# EAGLE board Easy_RFPA_RevC (EAGLE 6.6.0)
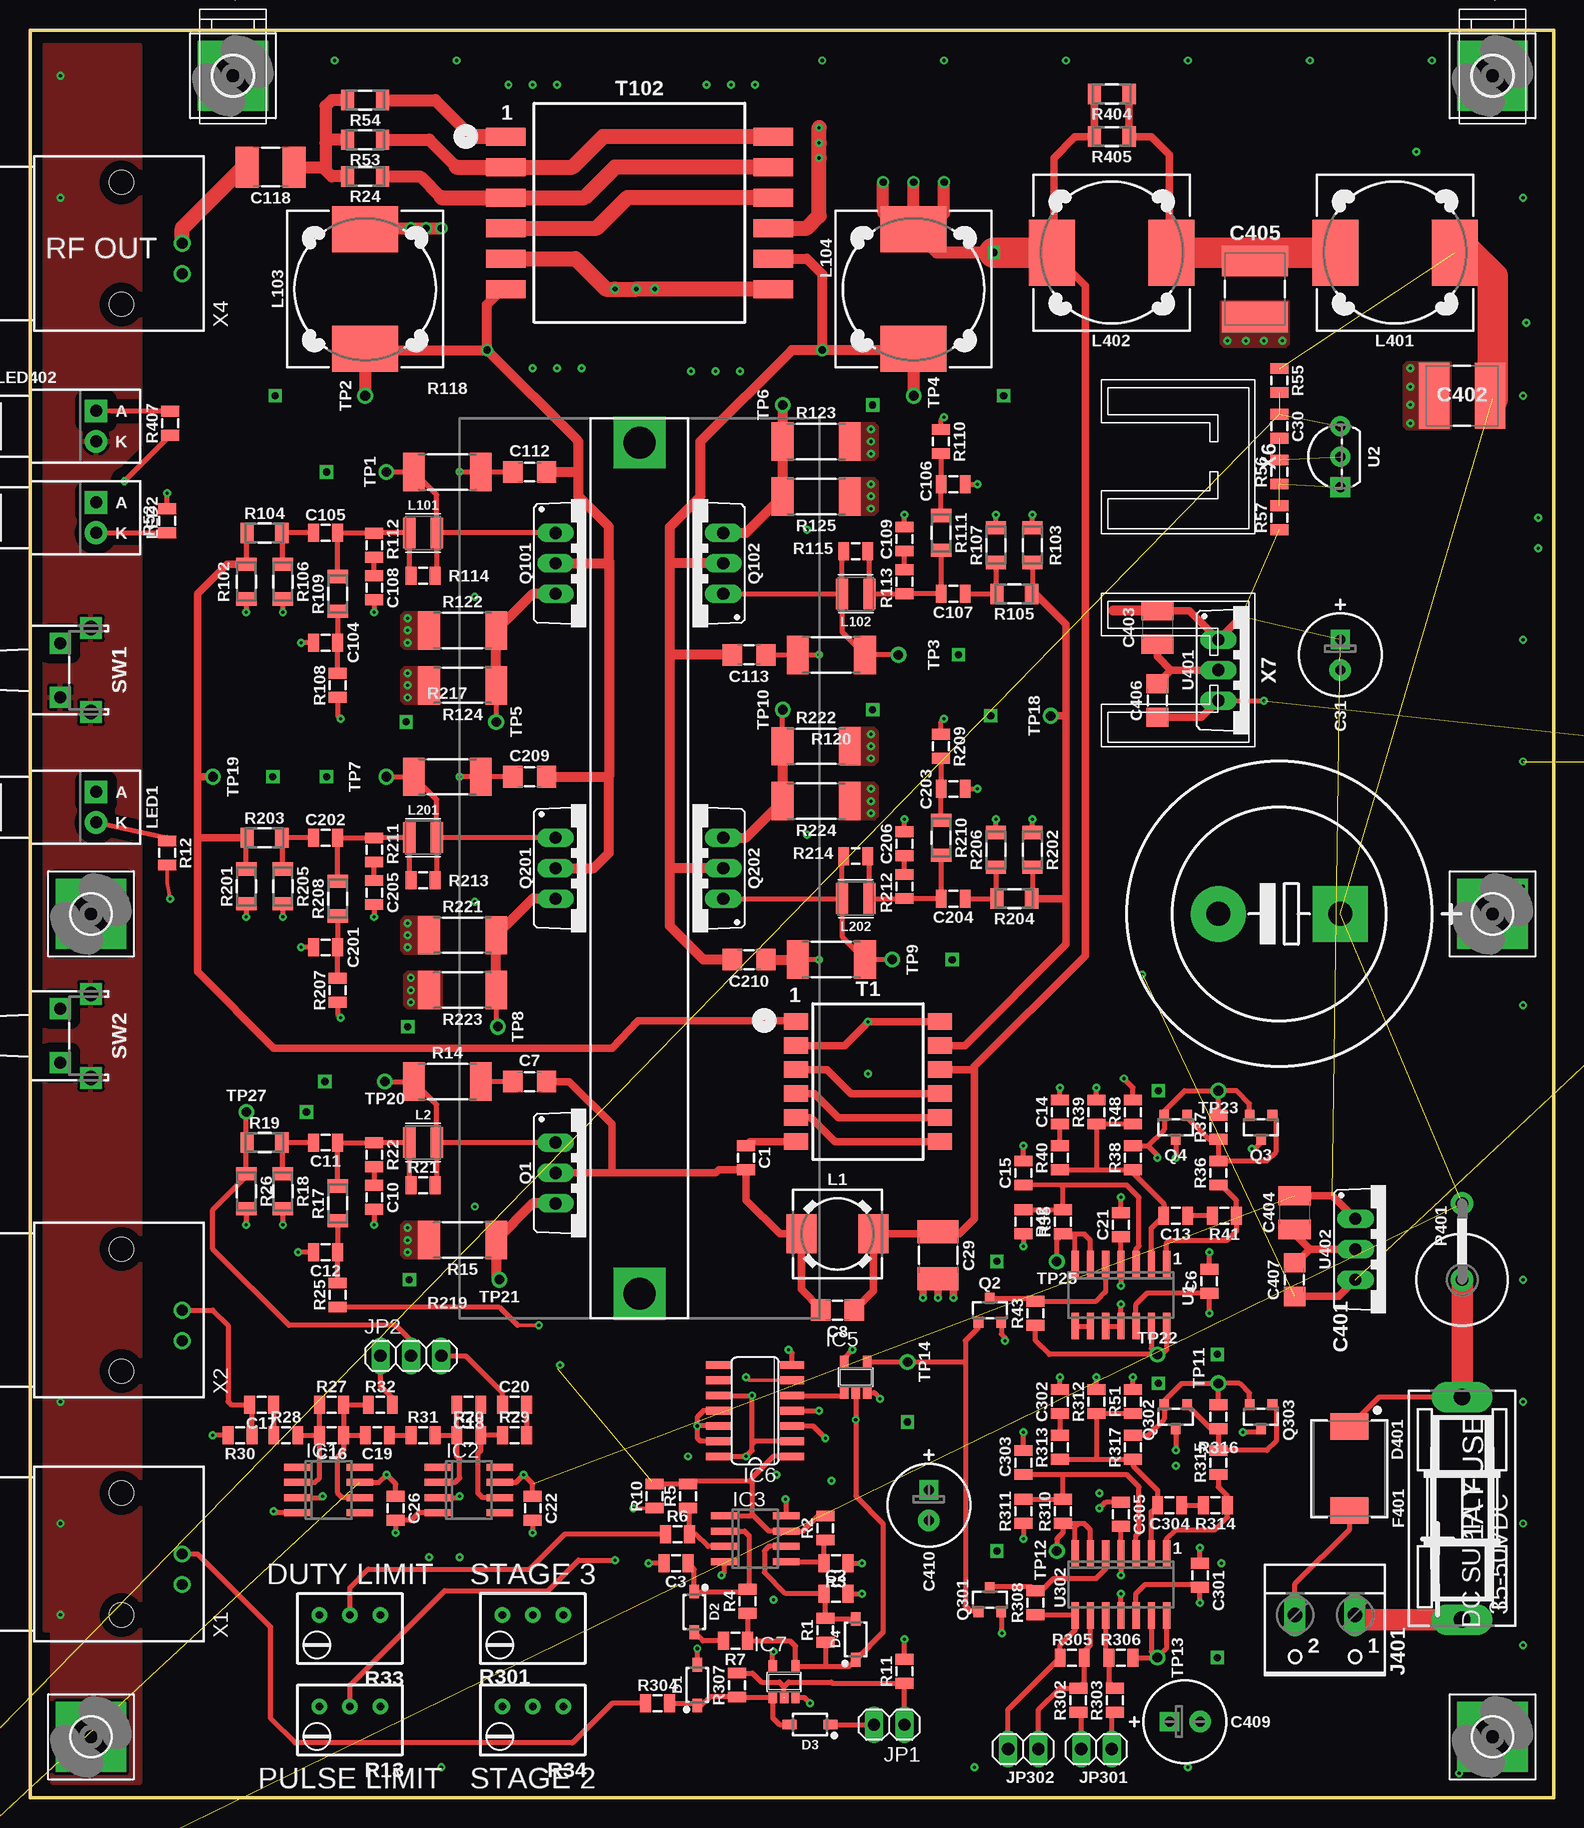
[diagram p6: board, top side]
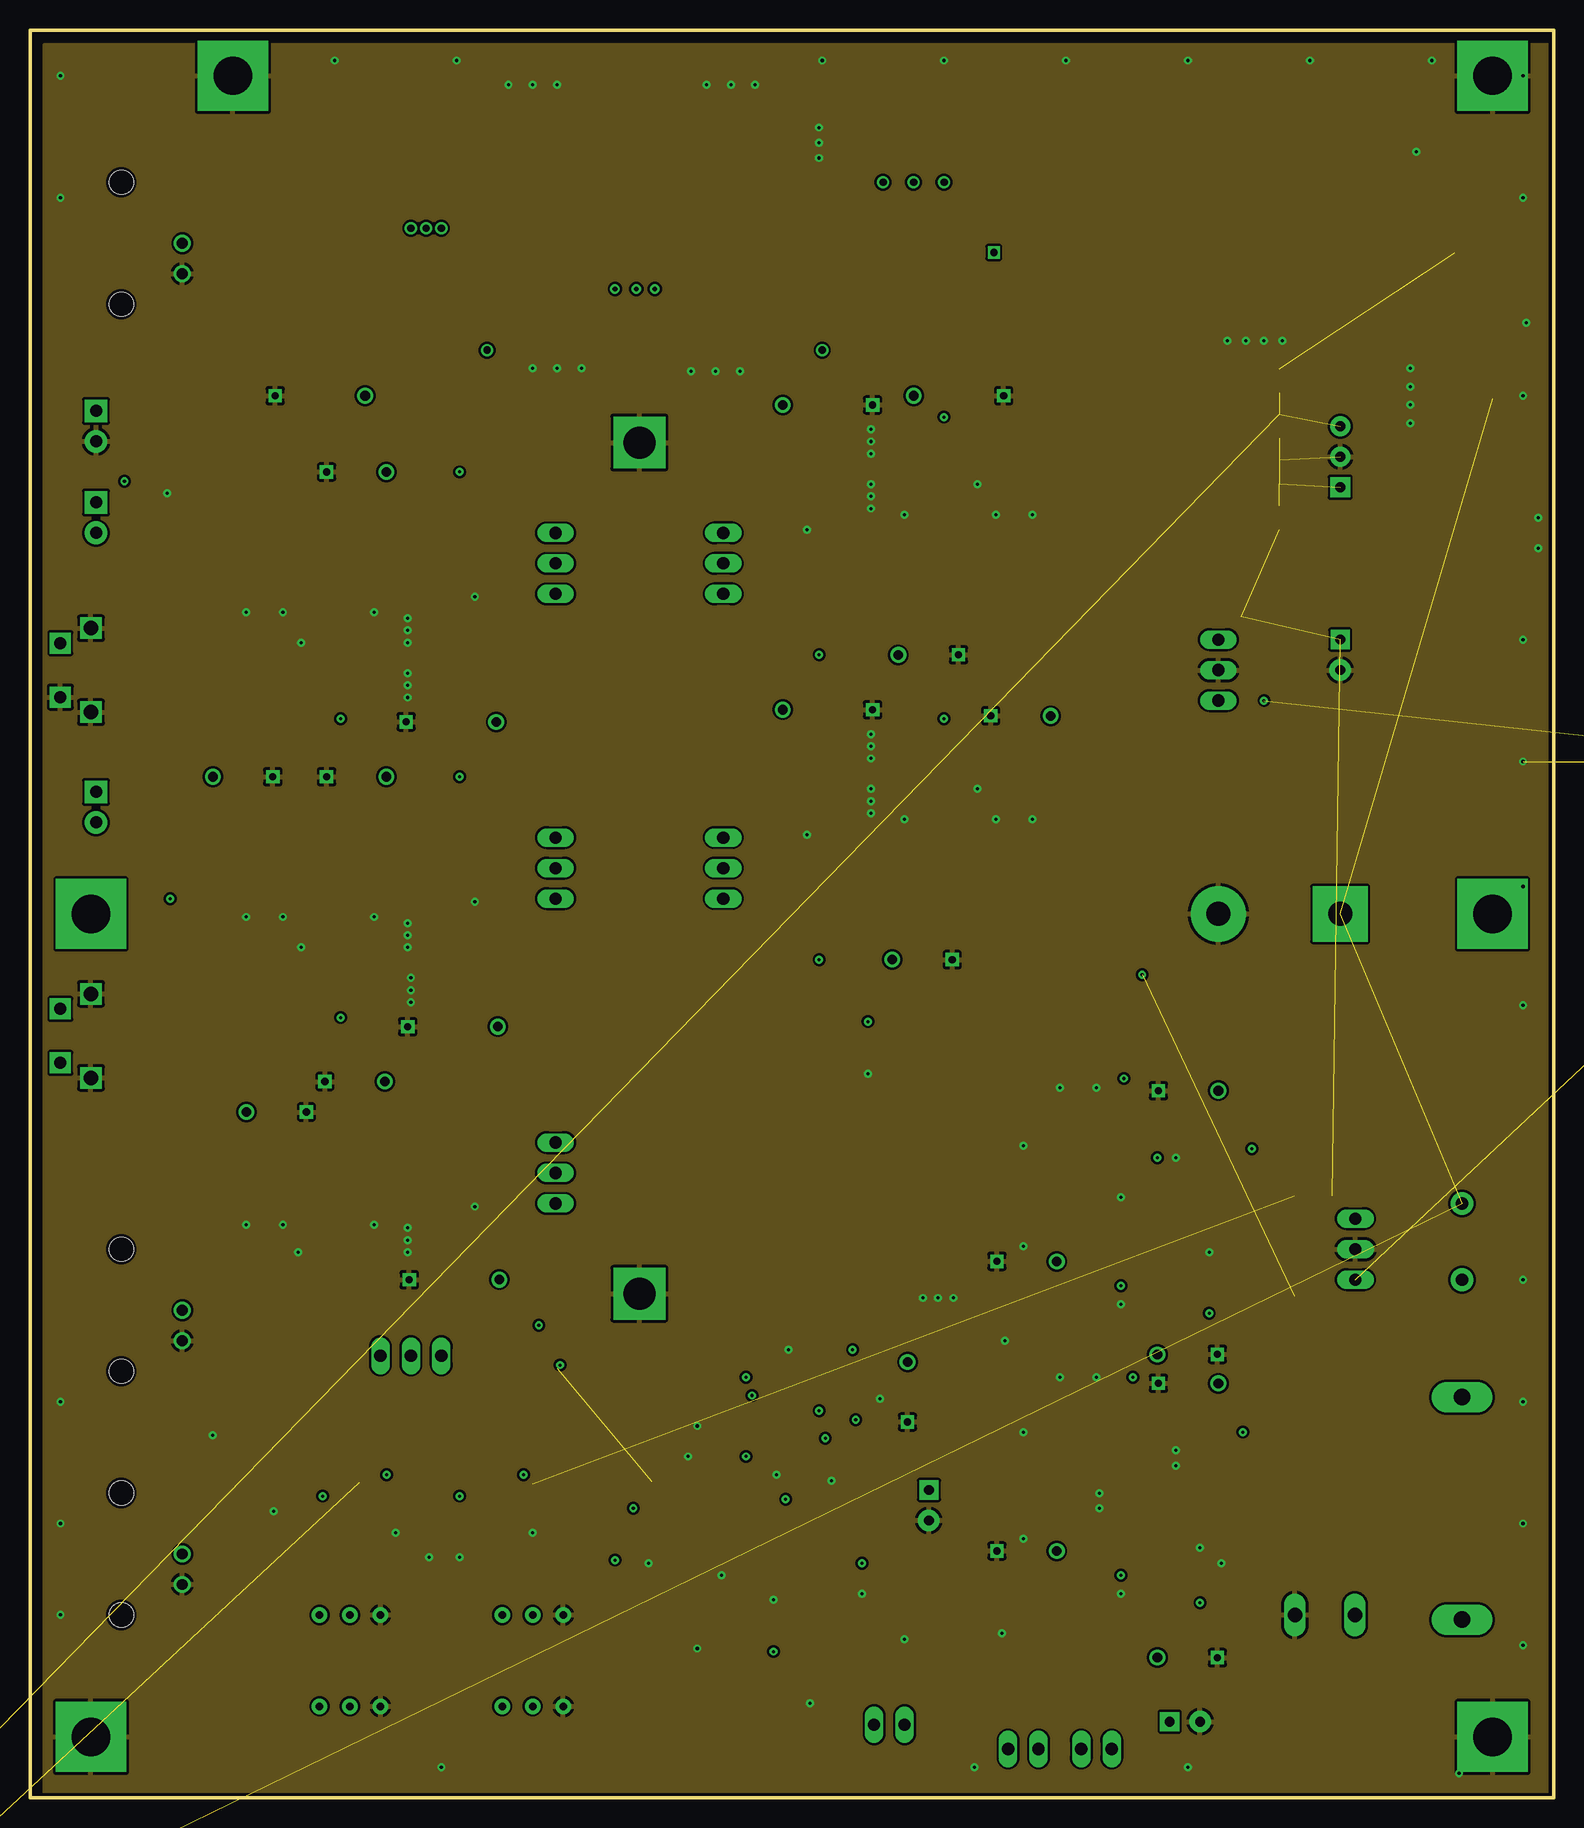
[diagram p7: board, inner layer Route2]
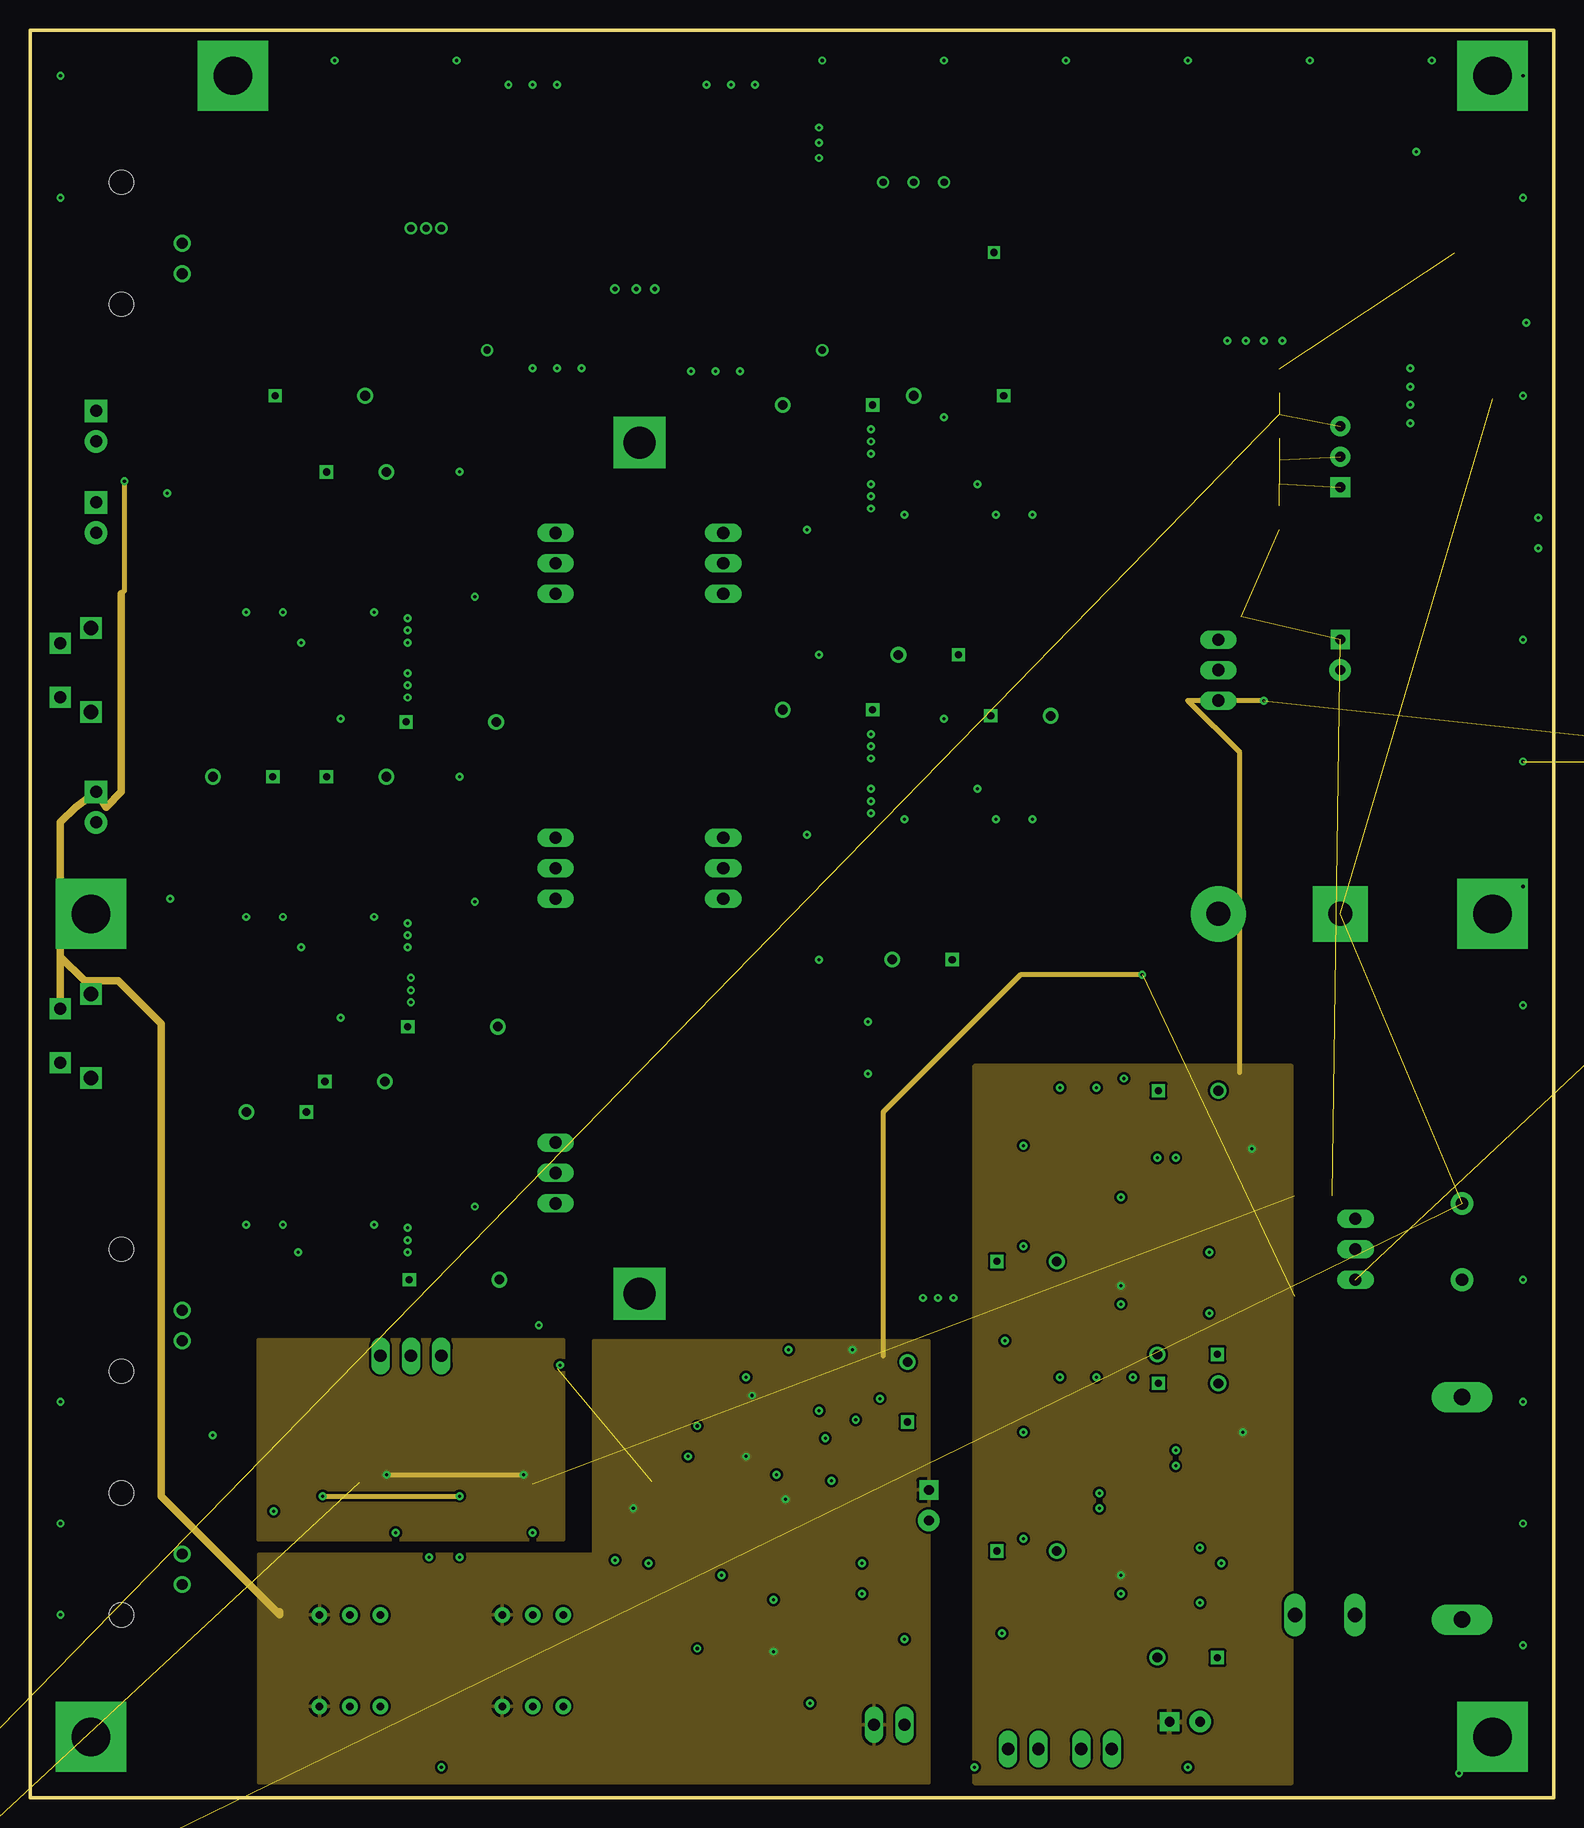
[diagram p8: board, inner layer Route15]
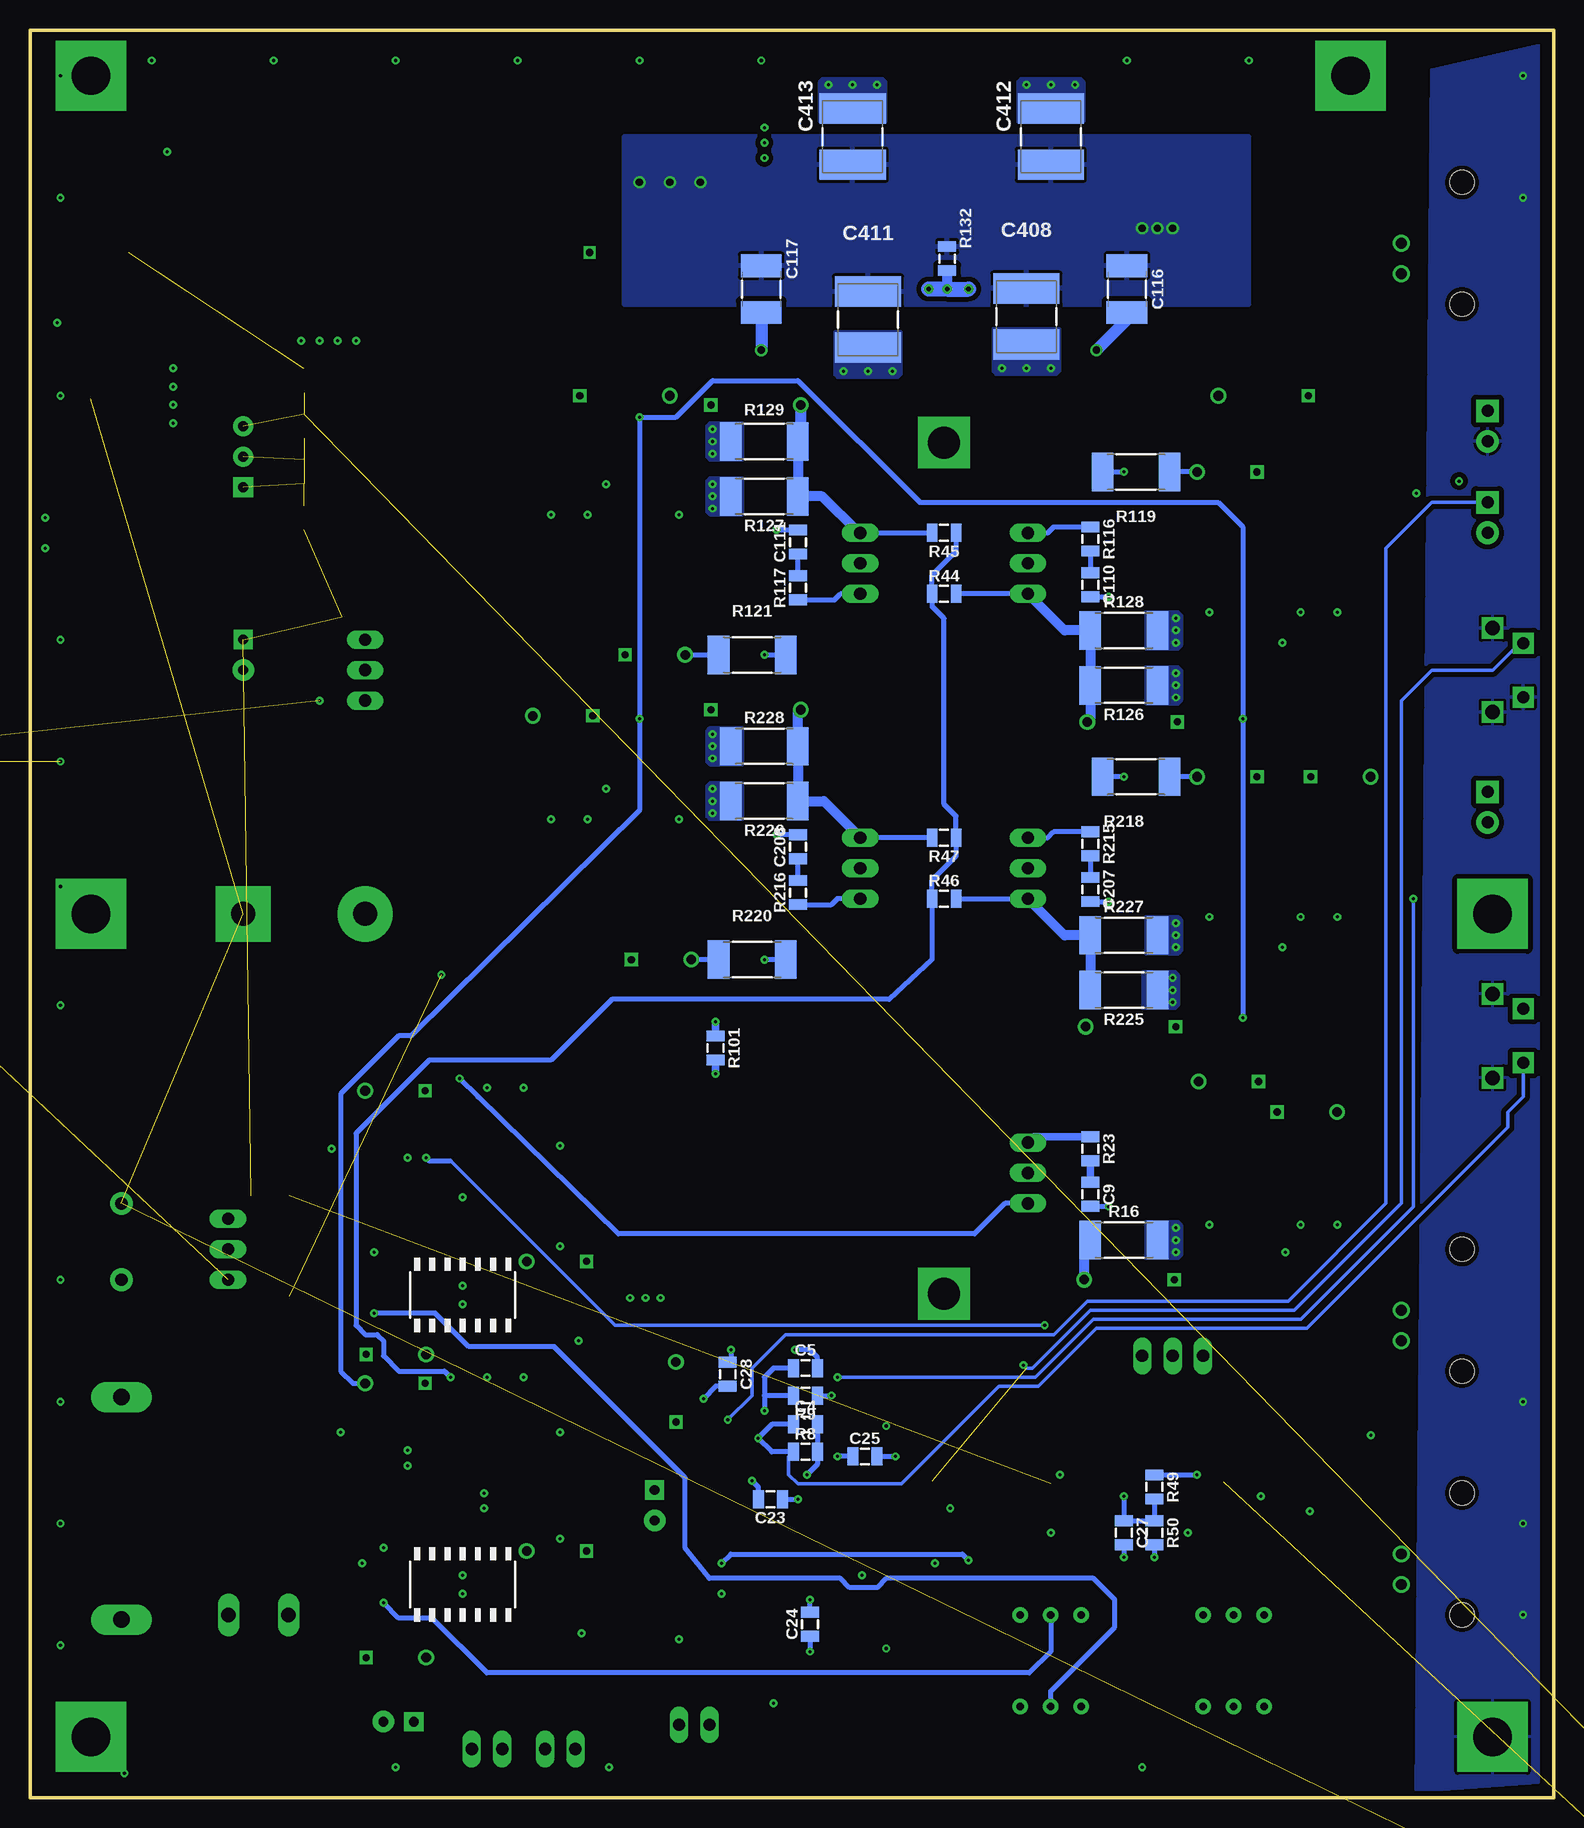
[diagram p9: board, bottom side, seen from below]

Size 127 x 147.32 mm. Coordinates in mm from the lower left corner, seen from the top.
Outline: 0,0 127,0 127,147.32 0,147.32 0,0
Copper layers (1+2*15+16): Top 0.035mm / dielectric 1.5mm / Route2 0.035mm / dielectric 0.15mm / Route15 0.035mm / dielectric 0.2mm / Bottom 0.035mm
Design rules "default *": minimum track width 10mil, minimum drill 10mil, track to track 8mil, track to pad 8mil, pad to pad 8mil, via to via 8mil, smd to smd 0mil, copper to edge 10mil, drill to drill 8mil, minimum pad ring 10mil, minimum via ring 8mil, stop-mask expansion 4mil, vias tented up to drill 10mil, thermal gap 10mil
Net classes: 1 32W_20S: width 0.813 mm, drill 0.6 mm, clearance 0.508 mm; 2 32W_30S: width 0.813 mm, drill 0.6 mm, clearance 0.762 mm; 3 50W_30S: width 1.27 mm, drill 0.6 mm, clearance 0.762 mm

## Footprints (pad centres in the part's own frame; a part is rotated, then mirrored left to right if it is on the bottom)
0805_IPC-7351B = smd 0.9 x 1.5: 1 -1,0; 2 1,0
C1206 = smd 1.6 x 1.8: 1 -1.4,0; 2 1.4,0
C1812 = smd 1.9 x 3.4: 1 -1.95,0; 2 1.95,0
E2,5-7 = drill 0.813 pad 1.6 square: + -1.27,0 | drill 0.813 pad 1.778: - 1.27,0
EB25D = drill 2.007 pad 4.597 square: + -5.08,0 | drill 2.007 pad 4.597: - 5.08,0
C2220_CKG57N = smd 2.53 x 5.51: 1 -2.335,0; 2 2.335,0
C1210 = smd 1.6 x 2.7: 1 -1.4,0; 2 1.4,0
SOD123 = smd 1.15 x 0.8: A 1.7,0; K -1.7,0
DO-214AB(SMC) = smd 2.2 x 3.15: A 3.5,0; K -3.5,0
02540121Z = drill 1.4 pad 2.54 long: 1 -9.271,0; 2 9.271,0
3,2-PAD-SQUARE = drill 3.2 pad 5.842 square: B3,2 0,0
SO08 = smd 0.6 x 2.2: 1 -1.905,-2.6; 2 -0.635,-2.6; 3 0.635,-2.6; 4 1.905,-2.6; 5 1.905,2.6; 6 0.635,2.6; 7 -0.635,2.6; 8 -1.905,2.6
SOT23-5 = smd 0.69 x 0.99: 1 -0.95,-1.29; 2 0,-1.29; 3 0.95,-1.29; 4 0.95,1.3; 5 -0.95,1.3
SO14 = smd 0.66 x 2.032: 1 -3.81,-3.073; 2 -2.54,-3.073; 3 -1.27,-3.073; 4 0,-3.073; 5 1.27,-3.073; 6 2.54,-3.073; 7 3.81,-3.073; 8 3.81,3.073; 9 2.54,3.073; 10 1.27,3.073; 11 0,3.073; 12 -1.27,3.073; 13 -2.54,3.073; 14 -3.81,3.073
W237-02 = drill 1.194 long: 1 -2.5,-1.27; 2 2.5,-1.27
47053-1000 = drill 1 pad 1.93 square: 1 3.81,0 | drill 1 pad 1.93: 2 1.27,0; 3 -1.27,0; 4 -3.81,0 | hole 1.3: -1.27,-2.16
1X02 = drill 1.016 long: 1 -1.27,0; 2 1.27,0
1X03 = drill 1.016 long: 1 -2.54,0; 2 0,0; 3 2.54,0
DR74 = smd 2.5 x 3.25: 1 -3,0; 2 3,0
L1008 = smd 1.02 x 2.54: 1 -1.145,0; 2 1.145,0
DR127 = smd 3.85 x 5.5: 1 -4.975,0; 2 4.975,0
LED_5MM_RA = drill 1 pad 1.905 square: A 5.5,1.27 | drill 1 pad 1.905: K 5.5,-1.27
TO220BV = drill 1.016 long: D 0,-2.54; G -2.54,-2.54; S 2.54,-2.54
SOT23R_INFINEON = smd 0.8 x 0.9: 1 -0.95,-1; 2 0.95,-1; 3 0,1
RTRIM3299W = drill 0.61 pad 1.27: 1 1.27,-2.54; 2 1.27,0; 3 1.27,2.54
R2512 = smd 1.8 x 3.2: 1 -2.8,0; 2 2.8,0
1206_IPC-7351B = smd 1.1 x 1.7: 1 -1.45,0; 2 1.45,0
P0817V = drill 1.016 pad 1.905: 1 -5.08,0; 2 1.27,0
431256083716 = drill 1.2 square: 1 -3.5,2.54; 4 3.5,2.54 | drill 1 pad 1.75 square: 2 -2.25,0; 3 2.25,0
HP1 = smd 2 x 1.4: 1 -6,5; 2 -6,3; 3 -6,1; 4 -6,-1; 5 -6,-3; 6 -6,-5; 7 6,-5; 8 6,-3; 9 6,-1; 10 6,1; 11 6,3; 12 6,5
HP4 = smd 3.3 x 1.5: 1 -11.15,6.35; 2 -11.15,3.81; 3 -11.15,1.27; 4 -11.15,-1.27; 5 -11.15,-3.81; 6 -11.15,-6.35; 7 11.15,-6.35; 8 11.15,-3.81; 9 11.15,-1.27; 10 11.15,1.27; 11 11.15,3.81; 12 11.15,6.35
PROBE_TP_5MM = drill 0.6 square: GND 5,0 | drill 0.8: TP 0,0
PROBE_TP_7P5MM = drill 0.6 square: GND 7.5,0 | drill 0.8: TP 0,0
SO14' = smd 0.6 x 2.2: 1 -3.81,-2.6; 2 -2.54,-2.6; 3 -1.27,-2.6; 4 0,-2.6; 5 1.27,-2.6; 6 2.54,-2.6; 7 3.81,-2.6; 8 3.81,2.6; 9 2.54,2.6; 10 1.27,2.6; 11 0,2.6; 12 -1.27,2.6; 13 -2.54,2.6; 14 -3.81,2.6
TO-92-FORMED = drill 0.813 pad 1.676 square: 1 -2.54,0 | drill 0.813 pad 1.676: 2 0,0; 3 2.54,0
TO220BV' = drill 1.016 long: 1 -2.54,-2.54; 2 0,-2.54; 3 2.54,-2.54
AMP_227161 = drill 0.9 pad 1.27: 1 0,-5.08; 2 -2.54,-5.08 | hole 2: -5.08,0; 5.08,0
OMNI-UNI-30-75-D = drill 2.667 pad 4.318 square: P1 0,35.47; P2 0,-35.47

## Placement (x,y rotation side)
C1  27nF  [0805_IPC-7351B]  59.69,53.34 270 top
C2  0.1uF  [0805_IPC-7351B]  67.18,17.02 0 top
C3  10uF  [0805_IPC-7351B]  53.85,19.56 180 top
C4  10nF  [0805_IPC-7351B]  62.36,31.12 0 bottom
C5  1uF  [0805_IPC-7351B]  62.36,35.81 0 bottom
C6  0.1uF  [0805_IPC-7351B]  98.3,43.05 90 top
C7  2.2nF  [C1206]  41.66,59.69 0 top
C8  22nF  [C1206]  67.31,40.64 180 top
C9  DNP  [0805_IPC-7351B]  38.61,50.29 270 bottom
C10  DNP  [0805_IPC-7351B]  28.7,50.04 270 top
C11  4.7nF  [0805_IPC-7351B]  24.64,54.61 180 top
C12  22nF  [0805_IPC-7351B]  24.64,45.47 180 top
C13  33pF  [0805_IPC-7351B]  95.5,48.51 180 top
C14  DNP  [0805_IPC-7351B]  85.85,57.15 90 top
C15  DNP  [0805_IPC-7351B]  82.8,52.07 90 top
C16  10pF  [0805_IPC-7351B]  25.15,30.23 180 top
C17  22nF  [0805_IPC-7351B]  19.3,32.77 180 top
C18  10pF  [0805_IPC-7351B]  36.58,32.77 180 top
C19  22nF  [0805_IPC-7351B]  28.96,30.23 180 top
C20  22nF  [0805_IPC-7351B]  40.39,32.77 0 top
C21  0.1uF  [0805_IPC-7351B]  90.93,47.75 90 top
C22  0.1uF  [0805_IPC-7351B]  41.91,24.13 270 top
C23  0.1uF  [0805_IPC-7351B]  65.28,24.89 180 bottom
C24  0.1uF  [0805_IPC-7351B]  61.98,14.48 90 bottom
C25  0.1uF  [0805_IPC-7351B]  57.4,28.45 0 bottom
C26  0.1uF  [0805_IPC-7351B]  30.48,24.13 270 top
C27  0.1uF  [0805_IPC-7351B]  35.81,22.1 270 bottom
C28  0.1uF  [0805_IPC-7351B]  68.83,35.31 270 bottom
C29  DNP  [C1812]  75.69,45.21 270 top
C30  33pF  [0805_IPC-7351B]  104.14,114.3 270 top
C31  22uF  [E2,5-7]  109.22,95.25 270 top
C104  22nF  [0805_IPC-7351B]  24.64,96.27 180 top
C105  27nF  [0805_IPC-7351B]  24.64,105.41 180 top
C106  22nF  [0805_IPC-7351B]  76.96,109.47 0 top
C107  27nF  [0805_IPC-7351B]  76.96,100.33 0 top
C108  DNP  [0805_IPC-7351B]  28.7,100.84 270 top
C109  DNP  [0805_IPC-7351B]  72.9,104.9 90 top
C110  DNP  [0805_IPC-7351B]  38.61,101.09 270 bottom
C111  DNP  [0805_IPC-7351B]  62.99,104.65 90 bottom
C112  2.2nF  [C1206]  41.66,110.49 0 top
C113  2.2nF  [C1206]  59.94,95.25 180 top
C116  DNP  [C1812]  35.56,125.73 270 bottom
C117  DNP  [C1812]  66.04,125.73 270 bottom
C118  DNP  [C1812]  20.07,135.89 180 top
C201  22nF  [0805_IPC-7351B]  24.64,70.87 180 top
C202  27nF  [0805_IPC-7351B]  24.64,80.01 180 top
C203  22nF  [0805_IPC-7351B]  76.96,84.07 0 top
C204  27nF  [0805_IPC-7351B]  76.96,74.93 0 top
C205  DNP  [0805_IPC-7351B]  28.7,75.44 270 top
C206  DNP  [0805_IPC-7351B]  72.9,79.5 90 top
C207  DNP  [0805_IPC-7351B]  38.61,75.69 270 bottom
C208  DNP  [0805_IPC-7351B]  62.99,79.25 90 bottom
C209  2.2nF  [C1206]  41.66,85.09 0 top
C210  2.2nF  [C1206]  59.94,69.85 180 top
C301  0.1uF  [0805_IPC-7351B]  97.54,18.54 90 top
C302  DNP  [0805_IPC-7351B]  85.85,33.02 90 top
C303  DNP  [0805_IPC-7351B]  82.8,27.94 90 top
C304  33pF  [0805_IPC-7351B]  95,24.38 180 top
C305  0.1uF  [0805_IPC-7351B]  90.93,23.62 90 top
C401  3300uF  [EB25D]  104.14,73.66 180 top
C402  10uF  [C2220_CKG57N]  119.38,116.84 180 top
C403  6.8uF  [C1210]  93.98,97.54 270 top
C404  6.8uF  [C1210]  105.41,48.77 270 top
C405  10uF  [C2220_CKG57N]  102.11,125.73 270 top
C406  4.7uF  [C1206]  93.98,91.44 90 top
C407  4.7uF  [C1206]  105.41,43.18 90 top
C408  10uF  [C2220_CKG57N]  43.94,123.44 270 bottom
C409  22uF  [E2,5-7]  96.27,6.35 0 top
C410  22uF  [E2,5-7]  74.93,24.38 270 top
C411  10uF  [C2220_CKG57N]  57.15,123.19 270 bottom
C412  10uF  [C2220_CKG57N]  41.91,138.43 90 bottom
C413  10uF  [C2220_CKG57N]  58.42,138.43 90 bottom
D1  D-SCHOTTKY1N5711W-7-FSOD123  [SOD123]  55.63,9.4 90 top
D2  D-SCHOTTKY1N5711W-7-FSOD123  [SOD123]  55.37,15.49 270 top
D3  D-SCHOTTKY1N5711W-7-FSOD123  [SOD123]  65.02,6.1 180 top
D4  D-SCHOTTKY1N5711W-7-FSOD123  [SOD123]  68.83,13.21 90 top
D401  D-SCHOTTKYSK810L-TPSMC  [DO-214AB(SMC)]  109.98,27.43 270 top
F401  FUSE_2P  [02540121Z]  119.38,24.13 90 top
H1  MOUNT-PAD-SQUARE3.2  [3,2-PAD-SQUARE]  5.08,73.66 0 top
H2  MOUNT-PAD-SQUARE3.2  [3,2-PAD-SQUARE]  121.92,73.66 0 top
H401  MOUNT-PAD-SQUARE3.2  [3,2-PAD-SQUARE]  5.08,5.08 0 top
H402  MOUNT-PAD-SQUARE3.2  [3,2-PAD-SQUARE]  121.92,5.08 0 top
H403  MOUNT-PAD-SQUARE3.2  [3,2-PAD-SQUARE]  121.92,143.51 0 top
H404  MOUNT-PAD-SQUARE3.2  [3,2-PAD-SQUARE]  16.92,143.51 0 top
IC1  LM741D  [SO08]  24.89,25.65 270 top
IC2  LM741D  [SO08]  36.58,25.65 270 top
IC3  LM393D  [SO08]  60.45,21.59 270 top
IC5  74AHC1G00DBV  [SOT23-5]  68.83,35.05 0 top
IC6  74LS74D  [SO14]  60.45,32.26 90 top
IC7  74AHC1G86DBV  [SOT23-5]  62.87,9.65 0 top
J401  HDR_2X1282836-1282836-1  [W237-02]  107.95,13.97 180 top
J402  KK_PCFAN  [47053-1000]  148.59,86.36 0 top  (outside the outline)
JP1  [1X02]  71.63,6.1 180 top
JP2  [1X03]  31.75,36.83 0 top
JP301  [1X02]  88.9,4.06 180 top
JP302  [1X02]  82.8,4.06 180 top
L1  [DR74]  67.31,46.99 0 top
L2  47nH  [L1008]  32.77,54.61 0 top
L101  47nH  [L1008]  32.77,105.41 0 top
L102  47nH  [L1008]  68.83,100.33 180 top
L103  3.3uH  [DR127]  27.94,125.73 90 top
L104  3.3uH  [DR127]  73.66,125.73 90 top
L201  47nH  [L1008]  32.77,80.01 0 top
L202  47nH  [L1008]  68.83,74.93 180 top
L401  3.3uH  [DR127]  113.79,128.78 180 top
L402  22uH  [DR127]  90.17,128.78 180 top
LED1  LEDT1_3/4_RA  [LED_5MM_RA]  0,82.55 0 top
LED2  LEDT1_3/4_RA  [LED_5MM_RA]  0,106.68 0 top
LED402  LEDT1_3/4_RA  [LED_5MM_RA]  0,114.3 0 top
Q1  IRF630  [TO220BV]  46.35,52.07 270 top
Q2  MOSFET_NBSS123SOT23  [SOT23R_INFINEON]  80.01,40.64 0 top
Q3  NPNMMBT3904SOT23_BEC  [SOT23R_INFINEON]  102.62,55.88 180 top
Q4  PNPSOT23_BEC  [SOT23R_INFINEON]  95.5,55.88 180 top
Q6  NPN_DARGLINGTONTIP122TO220BV  [TO220BV]  -26.67,-19.05 0 top  (outside the outline)
Q101  IRF520N  [TO220BV]  46.35,102.87 270 top
Q102  IRF630  [TO220BV]  55.24,102.87 90 top
Q201  IRF630  [TO220BV]  46.35,77.47 270 top
Q202  IRF630  [TO220BV]  55.24,77.47 90 top
Q301  MOSFET_NBSS123SOT23  [SOT23R_INFINEON]  80.01,16.51 0 top
Q302  PNPSOT23_BEC  [SOT23R_INFINEON]  95.5,31.75 180 top
Q303  NPNMMBT3904SOT23_BEC  [SOT23R_INFINEON]  102.62,31.75 180 top
R1  10K  [0805_IPC-7351B]  66.29,13.97 90 top
R2  1M  [0805_IPC-7351B]  66.29,22.48 90 top
R3  1K  [0805_IPC-7351B]  67.18,19.56 180 top
R4  100K  [0805_IPC-7351B]  59.82,16.38 90 top
R5  1M  [0805_IPC-7351B]  54.86,25.15 90 top
R6  1K  [0805_IPC-7351B]  53.98,21.97 0 top
R7  10K  [0805_IPC-7351B]  58.8,13.08 180 top
R8  10K  [0805_IPC-7351B]  62.36,28.83 0 bottom
R9  100K  [0805_IPC-7351B]  62.36,33.53 180 bottom
R10  4.7K  [0805_IPC-7351B]  52.07,25.15 90 top
R11  10K  [0805_IPC-7351B]  72.9,10.54 90 top
R12  150  [0805_IPC-7351B]  11.43,78.74 270 top
R13  10K  [RTRIM3299W]  26.67,6.35 90 top
R14  1200  [R2512]  34.8,59.69 0 top
R15  3  [R2512]  36.07,46.48 180 top
R16  3  [R2512]  35.81,46.48 0 bottom
R17  500  [1206_IPC-7351B]  25.65,49.53 90 top
R18  DNP  [1206_IPC-7351B]  21.08,50.55 270 top
R19  0  [1206_IPC-7351B]  19.56,54.61 0 top
R20  300  [0805_IPC-7351B]  36.58,30.23 0 top
R21  15  [0805_IPC-7351B]  32.77,51.05 0 top
R22  DNP  [0805_IPC-7351B]  28.7,53.59 270 top
R23  DNP  [0805_IPC-7351B]  38.61,54.1 270 bottom
R24  0  [1206_IPC-7351B]  27.94,135.13 180 top
R25  100  [0805_IPC-7351B]  25.65,41.91 90 top
R26  DNP  [1206_IPC-7351B]  18.03,50.55 270 top
R27  300  [0805_IPC-7351B]  25.15,32.77 0 top
R28  100  [0805_IPC-7351B]  21.34,30.23 0 top
R29  50  [0805_IPC-7351B]  40.39,30.23 0 top
R30  100  [0805_IPC-7351B]  17.53,30.23 180 top
R31  100  [0805_IPC-7351B]  32.77,30.23 0 top
R32  50  [0805_IPC-7351B]  29.21,32.77 0 top
R33  10K  [RTRIM3299W]  26.67,13.97 90 top
R34  10K  [RTRIM3299W]  41.91,6.35 90 top
R35  1K  [0805_IPC-7351B]  86.11,48.01 90 top
R36  10  [0805_IPC-7351B]  99.06,52.07 90 top
R37  100  [0805_IPC-7351B]  99.06,55.88 90 top
R38  10K  [0805_IPC-7351B]  91.95,53.34 90 top
R39  10K  [0805_IPC-7351B]  88.9,57.15 270 top
R40  DNP  [0805_IPC-7351B]  85.85,53.34 270 top
R41  0  [0805_IPC-7351B]  99.57,48.51 180 top
R42  DNP  [0805_IPC-7351B]  82.8,48.01 270 top
R43  1K  [0805_IPC-7351B]  83.82,40.39 90 top
R44  1K  [0805_IPC-7351B]  50.8,100.33 0 bottom
R45  1K  [0805_IPC-7351B]  50.8,105.41 180 bottom
R46  1K  [0805_IPC-7351B]  50.8,74.93 0 bottom
R47  1K  [0805_IPC-7351B]  50.8,80.01 180 bottom
R48  DNP  [0805_IPC-7351B]  91.95,57.15 90 top
R49  10K  [0805_IPC-7351B]  33.27,25.91 270 bottom
R50  10K  [0805_IPC-7351B]  33.27,22.1 270 bottom
R51  DNP  [0805_IPC-7351B]  91.95,33.02 90 top
R52  150  [0805_IPC-7351B]  11.43,106.43 90 top
R53  0  [1206_IPC-7351B]  27.94,138.18 180 top
R54  0  [1206_IPC-7351B]  27.94,141.48 180 top
R55  590  [0805_IPC-7351B]  104.14,118.11 270 top
R56  590  [0805_IPC-7351B]  104.14,110.49 90 top
R57  590  [0805_IPC-7351B]  104.14,106.68 90 top
R101  0  [0805_IPC-7351B]  69.85,62.48 270 bottom
R102  75  [1206_IPC-7351B]  18.03,101.35 270 top
R103  75  [1206_IPC-7351B]  83.57,104.39 90 top
R104  4.99  [1206_IPC-7351B]  19.56,105.41 0 top
R105  4.99  [1206_IPC-7351B]  82.04,100.33 180 top
R106  75  [1206_IPC-7351B]  21.08,101.35 270 top
R107  75  [1206_IPC-7351B]  80.52,104.39 90 top
R108  100  [0805_IPC-7351B]  25.65,92.71 90 top
R109  100  [1206_IPC-7351B]  25.65,100.33 90 top
R110  100  [0805_IPC-7351B]  75.95,113.03 270 top
R111  100  [1206_IPC-7351B]  75.95,105.41 270 top
R112  DNP  [0805_IPC-7351B]  28.7,104.39 270 top
R113  DNP  [0805_IPC-7351B]  72.9,101.35 90 top
R114  15  [0805_IPC-7351B]  32.77,101.85 0 top
R115  15  [0805_IPC-7351B]  68.83,103.89 180 top
R116  DNP  [0805_IPC-7351B]  38.61,104.9 270 bottom
R117  DNP  [0805_IPC-7351B]  62.99,100.84 90 bottom
R118  330  [R2512]  34.8,110.49 0 top
R119  270  [R2512]  34.8,110.49 180 bottom
R120  330  [R2512]  66.8,95.25 180 top
R121  270  [R2512]  66.8,95.25 0 bottom
R122  2.7  [R2512]  36.07,97.28 180 top
R123  2.7  [R2512]  65.53,113.03 0 top
R124  2.7  [R2512]  36.07,92.71 180 top
R125  2.7  [R2512]  65.53,108.46 0 top
R126  2.7  [R2512]  35.81,92.71 0 bottom
R127  2.7  [R2512]  65.79,108.46 180 bottom
R128  3.3  [R2512]  35.81,97.28 0 bottom
R129  3.3  [R2512]  65.79,113.03 180 bottom
R132  0  [0805_IPC-7351B]  50.55,128.27 270 bottom
R201  75  [1206_IPC-7351B]  18.03,75.95 270 top
R202  75  [1206_IPC-7351B]  83.57,78.99 90 top
R203  4.99  [1206_IPC-7351B]  19.56,80.01 0 top
R204  4.99  [1206_IPC-7351B]  82.04,74.93 180 top
R205  75  [1206_IPC-7351B]  21.08,75.95 270 top
R206  75  [1206_IPC-7351B]  80.52,78.99 90 top
R207  100  [0805_IPC-7351B]  25.65,67.31 90 top
R208  100  [1206_IPC-7351B]  25.65,74.93 90 top
R209  100  [0805_IPC-7351B]  75.95,87.63 270 top
R210  100  [1206_IPC-7351B]  75.95,80.01 270 top
R211  DNP  [0805_IPC-7351B]  28.7,78.99 270 top
R212  DNP  [0805_IPC-7351B]  72.9,75.95 90 top
R213  15  [0805_IPC-7351B]  32.77,76.45 0 top
R214  15  [0805_IPC-7351B]  68.83,78.49 180 top
R215  DNP  [0805_IPC-7351B]  38.61,79.5 270 bottom
R216  DNP  [0805_IPC-7351B]  62.99,75.44 90 bottom
R217  330  [R2512]  34.8,85.09 0 top
R218  270  [R2512]  34.8,85.09 180 bottom
R219  330  [R2512]  66.8,69.85 180 top
R220  270  [R2512]  66.8,69.85 0 bottom
R221  2.7  [R2512]  36.07,71.88 180 top
R222  2.7  [R2512]  65.53,87.63 0 top
R223  2.7  [R2512]  36.07,67.31 180 top
R224  2.7  [R2512]  65.53,83.06 0 top
R225  2.7  [R2512]  35.81,67.31 0 bottom
R226  2.7  [R2512]  65.79,83.06 180 bottom
R227  3.3  [R2512]  35.81,71.88 0 bottom
R228  3.3  [R2512]  65.79,87.63 180 bottom
R301  10K  [RTRIM3299W]  41.91,13.97 90 top
R302  10K  [0805_IPC-7351B]  87.38,8.13 90 top
R303  10K  [0805_IPC-7351B]  90.42,8.13 90 top
R304  1K  [0805_IPC-7351B]  52.32,7.87 0 top
R305  10K  [0805_IPC-7351B]  86.87,11.68 180 top
R306  10K  [0805_IPC-7351B]  90.93,11.68 0 top
R307  100K  [0805_IPC-7351B]  58.93,9.4 90 top
R308  1K  [0805_IPC-7351B]  83.82,16.26 90 top
R310  1K  [0805_IPC-7351B]  86.11,23.88 90 top
R311  DNP  [0805_IPC-7351B]  82.8,23.88 270 top
R312  10K  [0805_IPC-7351B]  88.9,33.02 270 top
R313  DNP  [0805_IPC-7351B]  85.85,29.21 270 top
R314  0  [0805_IPC-7351B]  98.81,24.38 180 top
R315  10  [0805_IPC-7351B]  99.06,27.94 90 top
R316  100  [0805_IPC-7351B]  99.06,31.75 90 top
R317  10K  [0805_IPC-7351B]  91.95,29.21 90 top
R401  1.0  [P0817V]  119.38,48.26 90 top
R404  1.0  [1206_IPC-7351B]  90.17,141.99 180 top
R405  0.5  [1206_IPC-7351B]  90.17,138.43 180 top
R407  590  [0805_IPC-7351B]  11.68,114.55 90 top
R408  10K  [0805_IPC-7351B]  146.3,77.72 90 top  (outside the outline)
SW1  SPST_NO_TACT_RA431256083716431256083716  [431256083716]  2.54,93.98 270 top
SW2  SPST_NO_TACT_RA431256083716431256083716  [431256083716]  2.54,63.5 270 top
T1  HP1_TRAFO  [HP1]  69.85,59.69 0 top
T102  HP4_TRAFO  [HP4]  50.8,132.08 0 top
TP1  PROBE_TPTP_5MM  [PROBE_TP_5MM]  29.72,110.49 180 top
TP2  PROBE_TPTP_7P5MM  [PROBE_TP_7P5MM]  27.94,116.84 180 top
TP3  PROBE_TPTP_5MM  [PROBE_TP_5MM]  72.39,95.25 0 top
TP4  PROBE_TPTP_7P5MM  [PROBE_TP_7P5MM]  73.66,116.84 0 top
TP5  PROBE_TPTP_7P5MM  [PROBE_TP_7P5MM]  38.86,89.66 180 top
TP6  PROBE_TPTP_7P5MM  [PROBE_TP_7P5MM]  62.74,116.08 0 top
TP7  PROBE_TPTP_5MM  [PROBE_TP_5MM]  29.72,85.09 180 top
TP8  PROBE_TPTP_7P5MM  [PROBE_TP_7P5MM]  38.99,64.26 180 top
TP9  PROBE_TPTP_5MM  [PROBE_TP_5MM]  71.88,69.85 0 top
TP10  PROBE_TPTP_7P5MM  [PROBE_TP_7P5MM]  62.74,90.68 0 top
TP11  PROBE_TPTP_5MM  [PROBE_TP_5MM]  99.06,34.54 180 top
TP12  PROBE_TPTP_5MM  [PROBE_TP_5MM]  85.6,20.57 180 top
TP13  PROBE_TPTP_5MM  [PROBE_TP_5MM]  93.98,11.68 0 top
TP14  PROBE_TPTP_5MM  [PROBE_TP_5MM]  73.15,36.32 270 top
TP18  PROBE_TPTP_5MM  [PROBE_TP_5MM]  85.09,90.17 180 top
TP19  PROBE_TPTP_5MM  [PROBE_TP_5MM]  15.24,85.09 0 top
TP20  PROBE_TPTP_5MM  [PROBE_TP_5MM]  29.59,59.69 180 top
TP21  PROBE_TPTP_7P5MM  [PROBE_TP_7P5MM]  39.12,43.18 180 top
TP22  PROBE_TPTP_5MM  [PROBE_TP_5MM]  93.98,36.96 0 top
TP23  PROBE_TPTP_5MM  [PROBE_TP_5MM]  99.06,58.93 180 top
TP25  PROBE_TPTP_5MM  [PROBE_TP_5MM]  85.6,44.7 180 top
TP27  PROBE_TPTP_5MM  [PROBE_TP_5MM]  18.03,57.15 0 top
U1  OPAMP_QUADTLV274IDSOIC14  [SO14']  90.93,41.91 180 top
U2  ADJ_ZENERTL431AILPRAGTO-92-LPRE  [TO-92-FORMED]  109.22,111.76 90 top
U302  OPAMP_QUADTLV274IDSOIC14  [SO14']  90.93,17.78 180 top
U401  LDO_3TERMMC78M12CTGTO220_VERT  [TO220BV']  101.6,93.98 270 top
U402  LDO_3TERMMC78M05CTGTO220_VERT  [TO220BV']  113.03,45.72 270 top
U$1  [KEYSTONE_634]  16.92,143.51 0 top
U$2  [KEYSTONE_634]  121.92,143.51 0 top
X1  1-227161-0  [AMP_227161]  7.62,20.32 90 top
X2  1-227161-0  [AMP_227161]  7.62,40.64 90 top
X4  1-227161-0  [AMP_227161]  7.62,129.54 90 top
X6  HEATSINK_CLIPONATS-PCBT1085ATS-PCBT1085  [ATS-PCBT1085]  101.6,111.76 270 top
X7  HEATSINK_CLIPONATS-PCBT1085ATS-PCBT1085  [ATS-PCBT1085]  101.6,93.98 270 top
X402  HEATSINK_OMNI_DUALOMNI-UNI-30-75-D30-75-D  [OMNI-UNI-30-75-D]  50.8,77.47 0 top

## Tracks (layer width: path | path; a pad name or v marks a point on that pad's centre or on a via)
!BLANK_GATED
  Top 0.406: IC5.4 69.82,36.35 69.85,36.32 TP14.TP 77.98,36.32 | 77.98,36.32 77.98,16 78.4,15.58 78.99,15.58 Q301.1 | Q2.1 79.06,39.18 77.98,38.1 77.98,36.32
!FAULT  (via drill 0.25)  (1 unrouted)
  Top 0.305: 51.82,26.4 R10.2
  Top 0.406: 60.2,26.42 55.12,26.42 55.12,26.4 R5.2 R10.2 | 60.2,26.42 60.2,23.62 | R2.2 65.64,23.48 64.39,22.23 IC3.7 61.59,22.23 60.2,23.62 | IC3.1 60.07,23.5 60.2,23.62 | 60.2,26.42 60.2,26.67 61.98,28.45 IC6.1
  Bottom 0.305: SW1.2 2.83,96.23 5.08,93.98 10.16,93.98 12.7,91.44 12.7,49.53 21.59,40.64 38.61,40.64 43.43,35.81 43.94,35.81 v44.2,36.07
!READY  (via drill 0.25)
  Top 0.305: R12.2 11.43,76.2 v11.68,74.93 | IC6.6 59.94,34.8 v59.69,35.05
  Bottom 0.305: v11.68,74.93 11.68,49.28 21.08,39.88 38.35,39.88 43.18,35.05 v59.69,35.05
+5V  (via drill 0.25)  (2 unrouted)
  Top 0.305: R10.1 52.05,24.13 v50.29,24.13
  Top 0.406: D3.K JP1.2 | IC7.5 61.91,12.13 v61.98,12.19 | IC6.10 v60.2,33.53 60.2,29.46 | IC6.14 v59.69,28.45 60.2,28.96 60.2,29.46 | IC6.2 60.45,29.72 60.2,29.46 | IC3.8 63.05,24.83 v62.99,24.89 | IC5.5 67.88,36.64 v68.58,37.34 | R407.1 11.68,113.54 v7.87,109.73
  Top 0.61: C407.1 109.09,41.78 U402.3
  Route15 0.406: v92.71,68.58 82.55,68.58 71.12,57.15 71.12,36.83 | v7.87,109.73 7.87,100.58 7.62,100.33
  Route15 0.61: 7.62,100.33 7.62,83.82 6.35,82.55 LED1.A 3.81,82.55 2.54,81.28 SW2.2 2.54,70.1 4.57,68.07 7.37,68.07 10.92,64.52 10.92,25.15 20.83,15.24 20.83,15.49
  Bottom 0.406: C24.1 v61.98,12.19 | R9.1 v60.2,33.53 | C23.1 v62.99,24.89 | v68.58,37.34 68.58,36.56 C28.1 | C25.1 v59.69,28.45
  pour Route15 (rank 2): 19.05,20.32 46.99,20.32 46.99,38.1 74.93,38.1 74.93,1.27 19.05,1.27
+12V  (via drill 0.25)  (1 unrouted)
  Top 0.406: C305.1 U302.4 v90.93,18.54 | C21.1 U1.4 v90.93,42.67 | U401.3 v102.87,91.44 | v101.85,54.1 102.11,54.1 102.62,54.61 Q3.3 | Q303.3 102.35,30.48 v101.09,30.48
  Top 0.61: C406.1 97.66,90.04 U401.3
  Route15 0.406: v102.87,91.44 96.52,91.44 100.84,87.12 100.84,60.45
  pour Route15 (rank 2): 78.74,1.27 105.16,1.27 105.16,60.96 78.74,60.96
+24V  (via drill 0.25)  (5 unrouted)
  Top 0.406: C22.1 41.91,26.16 v41.15,26.92 40.51,26.29 IC2.7 | C26.1 30.48,26.16 v29.72,26.92 29.08,26.29 IC1.7
  Top 0.61: C403.1 96.64,98.94 U401.1 100.97,98.43 | C404.1 108.58,50.17 U402.1
  Top 0.813: C403.1 90.29,98.94
  Route15 0.406: v29.72,26.92 v41.15,26.92
  Bottom 0.406: R49.1 29.73,26.91 v29.72,26.92
  pour Route15 (rank 2): 19.05,21.59 44.45,21.59 44.45,38.1 19.05,38.1
ABN1
  Top 0.406: R202.1 83.57,75 R204.1 | R103.1 83.57,100.4 R105.1
  Top 0.61: R105.1 83.82,100.33 86.36,97.79 86.36,90.17 | 86.36,90.17 86.36,74.93 | 86.36,74.93 86.36,71.12 77.93,62.69 T1.11 | R204.1 86.36,74.93 | TP18.TP 86.36,90.17
ABP1
  Top 0.406: R102.1 18.03,105.34 R104.1 | R201.1 18.03,79.94 R203.1
  Top 0.61: R102.1 16.44,102.8 13.97,100.33 13.97,85.09 | T1.1 63.13,64.77 50.67,64.77 48.51,62.48 20.32,62.48 13.97,68.83 13.97,80.01 | 13.97,85.09 13.97,80.01 | R203.1 13.97,80.01 | TP19.TP 13.97,85.09
AN2
  Top 0.406: C107.2 R105.2 80.52,100.4 R107.1
AN3
  Top 0.406: R115.1 69.98,103.74 L102.1 72.88,100.33 R113.1 72.91,100.33 C107.1 75.95,100.35 R111.2
AN4
  Top 0.406: Q102.G L102.2 | L102.2 67.69,103.74 R115.2 | L102.2 67.69,97.16 R120.1 TP3.TP
  Bottom 0.406: R117.1 59.93,99.84 59.44,100.33 Q102.G | TP3.TP R120.1
AN5
  Top 0.813: Q102.S 59.68,105.41 R125.1 R123.1 TP6.TP
  Bottom 0.406: Q102.S R45.2
  Bottom 0.813: R123.1 62.75,113.05 62.75,116.06 TP6.TP R123.1 R129.1 R127.1 60.96,108.46 57.91,105.41 Q102.S
AP2
  Top 0.406: C105.2 R104.2 21.08,105.34 R106.1
AP3
  Top 0.406: R114.1 31.62,102 L101.1 28.72,105.41 R112.1 28.69,105.41 C105.1 25.65,105.39 R109.2
AP4
  Top 0.406: Q101.G L101.2 | L101.2 33.91,102 R114.2 | L101.2 33.91,108.58 R118.1 TP1.TP
  Bottom 0.406: Q101.G 43.8,105.39 42.18,105.39 41.66,105.92 38.62,105.92 R116.1 | TP1.TP R118.1
AP5
  Top 0.406: R124.1 TP5.TP 38.85,89.65
  Top 0.813: R124.1 R122.1 41.92,100.33 Q101.S
  Bottom 0.406: Q101.S R44.2
  Bottom 0.813: TP5.TP 38.61,89.92 R126.1 R128.1 40.77,97.28 Q101.S
BLANK_POL
  Top 0.406: IC7.2 62.87,9.27 | 62.87,9.27 63.25,9.65 66.8,9.65 66.91,9.54 R11.1 JP1.1 | R307.2 60.21,10.4 60.96,9.65 62.48,9.65 62.87,9.27
BN2
  Top 0.406: C204.2 R204.2 80.52,75 R206.1
BN3
  Top 0.406: R214.1 69.98,78.34 L202.1 72.88,74.93 R212.1 72.91,74.93 C204.1 75.95,74.95 R210.2
BN4
  Top 0.406: Q202.G L202.2 | L202.2 67.69,78.34 R214.2 | L202.2 67.69,71.76 R219.1 TP9.TP
  Bottom 0.406: R216.1 60.18,74.44 59.69,74.93 Q202.G | R219.1 TP9.TP
BN5
  Top 0.406: R222.1 TP10.TP 62.75,90.69
  Top 0.813: Q202.S 59.68,80.01 R224.1 R222.1
  Bottom 0.406: R47.2 Q202.S
  Bottom 0.813: TP10.TP 62.99,90.67 R228.1 62.99,83.32 R224.1 | R226.1 60.83,83.06 Q202.S
BP2
  Top 0.406: C202.2 R203.2 21.08,79.94 R205.1
BP3
  Top 0.406: R213.1 31.62,76.6 L201.1 28.72,80.01 R211.1 28.69,80.01 C202.1 25.65,79.99 R208.2
BP4
  Top 0.406: Q201.G L201.2 | L201.2 33.91,76.6 R213.2 | L201.2 33.91,83.18 R217.1 TP7.TP
  Bottom 0.406: R215.1 41.67,80.5 42.16,80.01 Q201.G | TP7.TP R217.1
BP5
  Top 0.406: R223.1 38.87,64.38 TP8.TP
  Top 0.813: R223.1 R221.1 41.92,74.93 Q201.S
  Bottom 0.406: R46.2 Q201.S
  Bottom 0.813: Q201.S 40.77,71.88 R227.1 R225.1
DRAINS_NEG  (via drill 0.6)
  Top 0.813: Q202.D 53.34,77.47 | 53.34,77.47 53.34,95.25 | 53.34,95.25 53.34,102.62 | Q102.D 53.59,102.87 53.34,102.62 | v66.04,120.65 66.04,127 64.77,128.27 T102.8 | C113.2 53.34,95.25 | C210.2 56.13,69.85 53.34,72.64 53.34,77.47 | 53.34,102.62 53.34,105.92 55.88,108.46 55.88,113.03 63.5,120.65 v66.04,120.65 | L104.1 72.39,120.65 v66.04,120.65
  Top 1.016: L104.1 TP4.TP
  Bottom 1.016: C117.2 v66.04,120.65
DRAINS_POS  (via drill 0.6)
  Top 0.813: Q201.D 46.99,77.47 48.26,78.74 48.26,85.09 | 48.26,103.12 48.26,85.09 | Q101.D 48.01,102.87 48.26,103.12 | C209.2 48.26,85.09 | 48.26,103.12 48.26,105.92 45.72,108.46 45.72,110.49 | 45.72,110.49 45.72,113.03 v38.1,120.65 | C112.2 45.72,110.49 | v38.1,120.65 38.1,124.46 39.37,125.73 T102.6 | L103.1 28.05,120.76 27.94,120.65 v38.1,120.65
  Top 1.016: L103.1 27.94,120.65 TP2.TP
  Bottom 1.016: C116.2 35.56,123.19 v38.1,120.65
GND  (via drill 0.25)  (2 unrouted)
  Top 0.406: C206.2 v72.9,81.53 | R206.2 v80.52,81.53 | R202.2 v83.57,81.53 | C203.2 v78.99,84.07 | C205.2 v28.7,73.41 | C201.2 v22.61,70.87 | R205.2 v21.08,73.41 | R201.2 v18.03,73.41 | R106.2 v21.08,98.81 | R102.2 v18.03,98.81 | C104.2 v22.61,96.27 | C108.2 v28.7,98.81 | R103.2 v83.57,106.93 | R107.2 v80.52,106.93 | C106.2 v78.99,109.47 | C109.2 v72.9,106.93 | U302.11 v90.93,17.02 | C303.2 v82.8,30.48 | R311.2 v82.8,21.59 | 90.93,24.64 C305.2 89.65,24.62 v89.15,24.13 | C302.2 v85.85,35.05 | R312.1 v88.9,35.05 | Q301.2 80.96,13.78 v81.03,13.72 | Q302.3 v95.5,28.96 | IC3.4 57.85,18.74 v57.66,18.54 | R11.2 v72.9,13.21 | R42.2 v82.8,45.97 | C6.2 v98.3,45.47 | Q2.2 80.96,38.67 81.28,38.35 v81.28,38.1 | U1.10 U1.11 v90.93,41.15 | IC6.13 55.88,29.72 55.63,29.97 v55.63,30.99 | v55.63,30.99 55.63,31.75 56.13,32.26 IC6.11 | IC6.12 v55.63,30.99 | IC6.7 63.52,37.06 v63.25,37.34 | C2.2 v69.34,17.02 | C3.2 v51.56,19.56 | IC5.3 70.38,33.76 v70.87,33.27 | Q4.3 v95.5,53.34 | C14.2 v85.85,59.18 | C15.2 v82.8,54.36 | C21.2 v90.93,50.04 | IC7.3 64.54,8.36 v65.02,7.87 | C22.2 v41.91,22.1 | v30.48,22.1 C26.2 30.5,23.11 31.75,23.11 32.38,23.75 IC2.4 | R30.2 v15.24,30.23 | IC1.4 20.45,23.75 v20.32,23.88 | C10.2 v28.7,47.75 | R18.2 v21.08,47.75 | R26.2 v18.03,47.75 | C12.2 v22.35,45.47 | R52.2 v11.43,108.71 | C301.2 v97.54,20.83 | D401.A 109.98,22.35 105.41,17.78 105.41,15.28 J401.2 | R39.1 v88.9,59.18 | D1.A v55.63,12.45
  Top 0.61: U401.2 95.12,93.98 | 95.12,93.98 C406.2 | C403.2 93.98,95.12 95.12,93.98 | C404.2 105.41,46.99 106.68,45.72 | 106.68,45.72 U402.2 | C407.2 105.54,44.58 106.68,45.72 | C29.2 v75.69,41.66 | C29.2 74.76,43.26 74.42,42.93 v74.42,41.66 | C29.2 76.63,43.26 76.96,42.93 v76.96,41.66
  Top 1.27: T102.9 64.77,130.81 65.79,131.83 v65.79,136.65 v65.79,137.92 v65.79,139.19
  Bottom 0.406: C24.2 v61.98,16.51 | C25.2 v54.86,28.45 | C28.2 69.83,34.31 v70.87,33.27 | C4.2 R8.2 61.36,27.8 v62.23,26.92 | C5.2 61.36,36.72 61.98,37.34 v63.25,37.34 | C27.2 v35.81,20.07 | R50.2 v33.27,20.07 | C208.2 64.75,80.25 v64.77,80.26 | C207.2 37.1,74.69 v37.08,74.68 | C9.2 37.1,49.29 v37.08,49.28 | C111.2 64.75,105.65 v64.77,105.66 | C110.2 37.1,100.09 v37.08,100.08 | C23.2 66.28,25.89 v66.8,26.42
  Bottom 0.61: R101.2 v69.85,60.32
  other vias: 89.15,25.4 99.31,19.56 31.5,72.9 31.5,71.88 31.5,70.87 31.75,68.33 31.75,67.31 31.75,66.29 31.5,98.3 31.5,97.28 31.5,96.27 31.5,93.73 31.5,92.71 31.5,91.69 70.1,107.44 70.1,108.46 70.1,109.47 70.1,112.01 70.1,113.03 70.1,114.05 70.1,82.04 70.1,83.06 70.1,84.07 70.1,86.61 70.1,87.63 70.1,88.65 115.06,117.6 115.06,119.13 115.06,116.08 115.06,114.55 101.35,121.41 99.82,121.41 102.87,121.41 104.39,121.41 95.5,27.69 25.4,144.78 35.56,144.78 66.04,144.78 76.2,144.78 86.36,144.78 96.52,144.78 106.68,144.78 116.84,144.78 2.54,143.51 2.54,133.35 2.54,33.02 2.54,22.86 2.54,15.24 34.29,2.54 78.74,2.54 96.52,2.54 124.46,143.51 124.46,133.35 124.71,122.94 124.46,116.84 125.73,106.68 124.46,96.52 124.46,86.36 124.46,75.95 124.46,66.04 124.46,43.18 124.46,33.02 124.46,22.86 124.46,12.7 45.97,119.13 115.57,137.16 125.73,104.14 119.13,2.03 31.5,45.47 31.5,46.48 31.5,47.5 43.94,119.13 41.91,119.13 39.88,142.75 41.91,142.75 43.94,142.75 56.39,142.75 58.42,142.75 60.45,142.75 59.18,118.87 57.15,118.87 55.12,118.87
  pour Bottom (isolate 0.406, rank 3): 1.27,1.27 11.43,0.51 10.16,144.02 1.27,146.05
  pour Top (no thermals): 31.24,73.41 34.04,73.41 34.04,70.36 31.24,70.36 30.99,70.61 30.99,73.15
  pour Top (no thermals): 31.5,68.83 34.29,68.83 34.29,65.79 31.5,65.79 31.24,66.04 31.24,68.58
  pour Top (no thermals): 31.24,98.81 34.04,98.81 34.04,95.76 31.24,95.76 30.99,96.01 30.99,98.55
  pour Top (no thermals): 31.24,94.23 34.04,94.23 34.04,91.19 31.24,91.19 30.99,91.44 30.99,93.98
  pour Top (no thermals): 70.36,106.93 67.56,106.93 67.56,109.98 70.36,109.98 70.61,109.73 70.61,107.19
  pour Top (no thermals): 70.36,111.51 67.56,111.51 67.56,114.55 70.36,114.55 70.61,114.3 70.61,111.76
  pour Top (no thermals): 70.36,81.53 67.56,81.53 67.56,84.58 70.36,84.58 70.61,84.33 70.61,81.79
  pour Top (no thermals): 70.36,86.11 67.56,86.11 67.56,89.15 70.36,89.15 70.61,88.9 70.61,86.36
  pour Top (isolate 0.813, rank 3): 9.14,1.27 1.91,1.27 1.91,13.97 1.27,13.97 1.27,146.05 9.14,146.05
  pour Top (no thermals): 31.24,48.01 34.04,48.01 34.04,44.96 31.24,44.96 30.99,45.21 30.99,47.75
  pour Route2: 1.27,146.05 149.86,146.05 149.86,-3.81 1.27,-3.81
  pour Bottom (no thermals): 31.24,48.01 34.04,48.01 34.04,44.96 31.24,44.96 30.99,45.21 30.99,47.75
  pour Bottom (no thermals): 70.36,81.53 67.56,81.53 67.56,84.58 70.36,84.58 70.61,84.33 70.61,81.79
  pour Bottom (no thermals): 70.36,86.11 67.56,86.11 67.56,89.15 70.36,89.15 70.61,88.9 70.61,86.36
  pour Bottom (no thermals): 31.24,73.41 34.04,73.41 34.04,70.36 31.24,70.36 30.99,70.61 30.99,73.15
  pour Bottom (no thermals): 31.5,68.83 34.29,68.83 34.29,65.79 31.5,65.79 31.24,66.04 31.24,68.58
  pour Bottom (no thermals): 70.36,106.93 67.56,106.93 67.56,109.98 70.36,109.98 70.61,109.73 70.61,107.19
  pour Bottom (no thermals): 70.36,111.51 67.56,111.51 67.56,114.55 70.36,114.55 70.61,114.3 70.61,111.76
  pour Bottom (no thermals): 31.24,98.81 34.04,98.81 34.04,95.76 31.24,95.76 30.99,96.01 30.99,98.55
  pour Bottom (no thermals): 31.24,94.23 34.04,94.23 34.04,91.19 31.24,91.19 30.99,91.44 30.99,93.98
  pour Bottom (no thermals): 41.15,118.87 41.15,122.43 46.74,122.43 46.74,118.87 46.48,118.62 41.4,118.62
  pour Bottom (no thermals): 44.7,143 44.7,139.7 39.12,139.7 39.12,143 39.37,143.26 44.45,143.26
  pour Bottom (no thermals): 61.21,143 61.21,139.7 55.63,139.7 55.63,143 55.88,143.26 60.96,143.26
  pour Bottom (no thermals): 54.36,118.62 54.36,122.17 59.94,122.17 59.94,118.62 59.69,118.36 54.61,118.36
  pour Top (no thermals): 99.31,121.16 99.31,124.71 104.9,124.71 104.9,121.16 104.65,120.9 99.57,120.9
  pour Top (no thermals): 114.81,119.63 118.36,119.63 118.36,114.05 114.81,114.05 114.55,114.3 114.55,119.38
MIDBIAS  (via drill 0.25)
  Top 0.406: IC1.3 24.26,25.02 v24.38,25.15 | IC2.3 35.69,25.02 v35.81,25.15
  Route15 0.406: v24.38,25.15 v35.81,25.15
  Bottom 0.406: R49.2 R50.1 C27.1 v35.81,25.15
N$1
  Top 0.406: U302.1 94.74,21.59 95.5,22.35 98.81,22.35 99.82,23.37 99.82,24.37 R314.1 99.81,25.16 99.06,25.91 R315.1
N$2
  Top 0.406: Q302.1 98.45,30.75 R316.1 R315.2 99.08,28.96 103.12,28.96 103.89,29.72 103.89,32.51 103.63,32.77 103.58,32.77 Q303.1
N$3
  Top 0.406: D3.A 62.48,6.1 61.91,6.67 IC7.1 61.88,8.4 R307.1 58.87,8.46 56.72,8.46 55.96,7.7 D1.K 55.45,7.87 R304.2
N$4  (via drill 0.25)
  Top 0.406: 63.5,95.25 R120.2 | C113.1 R120.2 | R120.2 v65.79,95.25
  Bottom 0.406: v65.79,95.25 R120.2
N$5
  Top 0.406: R113.2 C109.1
N$6
  Top 0.406: U302.6 88.39,22.35 87.88,22.86 87.38,22.86 | 87.38,22.86 86.12,22.86 R310.1 86.11,22.1 85.6,21.59 TP12.TP | U302.7 87.12,22.61 87.38,22.86
N$7
  Top 0.406: C304.1 R314.2
N$8
  Top 0.406: R109.1 25.65,96.28 C104.1 25.65,96.25 R108.2
N$9
  Top 0.406: C302.1 R313.1
N$10
  Top 0.406: C108.1 R112.2
N$11
  Bottom 0.406: R116.2 C110.1
N$12  (via drill 0.25)
  Top 0.406: C112.1 R119.2 v35.81,110.49
  Bottom 0.406: R119.2 v35.81,110.49
N$13
  Top 0.406: R111.1 75.95,109.46 C106.1 75.95,109.49 R110.2
N$14
  Top 0.406: U302.2 93.47,23.86 C304.2 94,25.64 91.95,27.69 R317.1 88.9,28.21 | R51.1 R312.2 88.9,28.21 | R313.2 88.9,28.21
N$15
  Top 0.406: R311.1 R310.2 86.11,26.92 | U302.3 92.2,21.84 92.46,22.1 92.46,25.91 91.44,26.92 86.11,26.92 | 86.11,26.92 82.82,26.92 C303.1
N$16
  Top 0.406: R303.2 89.93,9.62 R306.1 89.66,11.95 U302.10
N$17
  Bottom 0.406: R117.2 C111.1
N$18
  Top 0.406: JP302.2 81.53,7.35 R305.2 85.87,12.72 87.12,13.97 U302.8 87.05,15.26 R308.1
N$19
  Top 0.406: U302.9 88.39,12.7 87.87,12.18 R305.1 87.87,9.62 R302.2 87.36,9.14 85.85,9.14 84.07,7.37 JP302.1
N$20
  Top 0.406: JP301.2 87.63,6.87 R302.1
N$21
  Top 0.406: JP301.1 90.17,6.87 R303.1
  Bottom 0.406: 90.06,3.95 JP301.1
N$22  (via drill 0.25)
  Top 0.406: R51.2 v91.95,35.05
  Bottom 0.406: v91.95,35.05 92.46,35.56 96.27,35.56 97.54,36.83 97.54,38.1 98.04,38.61 99.06,38.61 99.82,39.37 99.82,55.37 93.73,61.47 83.57,61.47 78.49,66.55 55.37,66.55 51.83,69.83 51.83,74.9 R46.1 51.8,76.47 49.8,78.47 R47.1 49.8,81.8 50.8,82.8 50.8,98.3 51.8,99.3 R44.1 51.8,101.87 49.8,103.87 R45.1
N$23
  Top 0.406: U302.5 89.66,19.05 88.9,18.29 85.34,18.29 84.31,17.26 R308.2 83.47,17.61 80.11,17.61 Q301.3
N$24
  Top 0.406: U1.14 94.74,37.34 94.36,36.96 TP22.TP | U1.13 93.47,37.46 TP22.TP | TP22.TP 84.96,36.96 83.82,38.1 R43.1
N$25  (via drill 0.25)
  Top 0.406: U302.12 92.2,17.02 92.96,17.78 97.3,17.78 C301.1 | 98.03,17.54 C301.1 | v97.54,16.26 C301.1
  Bottom 0.406: R301.2 41.91,12.19 43.69,10.41 88.9,10.41 93.47,14.99 96.27,14.99 v97.54,16.26
N$26
  Top 0.406: R306.2 TP13.TP | U302.13 93.47,12.19 TP13.TP | U302.14 94.74,12.45 TP13.TP
N$29
  Top 1.016: R53.1 33.27,138.18 35.56,135.89
  Top 1.27: T102.12 47.75,138.43 45.21,135.89 T102.2 35.56,135.89
N$30
  Top 1.016: R54.1 33.78,141.48 36.83,138.43
  Top 1.27: T102.1 36.83,138.43
N$31
  Top 1.27: X4.1 12.7,130.81 17.78,135.89 C118.2
N$33
  Top 0.406: R407.2 6.79,115.55 LED402.A
N$34
  Top 0.406: C16.2 R27.1 | IC1.2 23.75,26.29 24.13,26.67 24.13,30.21 C16.2 | R28.2 C16.2
N$35
  Top 0.406: R210.1 75.95,84.06 C203.1 75.95,84.09 R209.2
N$36
  Top 0.406: R212.2 C206.1
N$38
  Bottom 0.406: R216.2 C208.1
N$39  (via drill 0.25)
  Top 0.406: 63.5,69.85 R219.2 v65.79,69.85
  Top 0.813: C210.1 63.5,69.85
  Bottom 0.406: R219.2 v65.79,69.85
N$40
  Top 0.406: R208.1 25.65,70.88 C201.1 25.65,70.85 R207.2
N$41
  Top 0.406: C20.2 R29.2
N$42
  Top 0.406: C205.1 R211.2
N$47
  Top 0.406: 95,128.93 L402.1
  Top 0.61: 95,128.93 95,136.91 93.47,138.43 R405.1 R404.1
  Top 2.54: L402.1 102.11,128.78 | 102.11,128.78 L401.2 | C405.1 102.11,128.78
N$48
  Bottom 0.406: R215.2 C207.1
N$49
  Top 0.61: T1.6 60.04,54.69 C1.1
N$50  (via drill 0.25)
  Top 0.406: C209.1 R218.2 v35.81,85.09
  Bottom 0.406: v35.81,85.09 R218.2
N$51  (1 unrouted)
N$52
  Top 1.016: R24.1 32.51,135.13 34.29,133.35
  Top 1.27: T102.11 48.77,135.89 46.23,133.35 T102.3 34.29,133.35
N$53
  Top 0.406: R304.1 48.51,7.87 45.21,4.57 22.1,4.57 20.07,6.6 20.07,14.22 13.97,20.32 X1.1
N$54
  Top 0.406: IC3.6 61.59,20.96 61.21,20.57 61.21,18.8 62.99,17.02 C2.1 66.29,16.91 R1.2 66.36,14.91 D4.A
N$55  (via drill 0.25)
  Top 0.406: IC6.4 v65.79,32.26
  Bottom 0.406: C5.1 65.02,35.81 65.79,35.05 65.79,33.53 | 65.79,33.53 v65.79,32.26 | R9.2 65.79,33.53
N$56
  Top 0.406: IC3.5 66.06,19.68 R3.2 66.18,21.37 R2.1
N$57
  Top 0.406: C17.1 20.3,30.26 R28.1
N$58
  Top 1.27: T102.4 47.24,130.81 49.78,133.35 T102.10
N$59  (via drill 0.25)
  Top 0.406: R3.1 v69.34,19.56 | R13.2 26.67,9.4 34.54,17.27 43.18,17.27 45.72,19.81 v48.77,19.81
  Bottom 0.406: v69.34,19.56 68.58,20.32 49.28,20.32 v48.77,19.81
N$60
  Top 0.406: R25.2 25.65,45.45 C12.1 25.65,45.48 R17.1
N$61
  Top 0.406: R22.2 C10.1
N$62
  Bottom 0.61: R23.2 C9.1
N$63
  Top 0.406: C7.1 R14.2
N$64  (via drill 0.25)
  Top 0.406: U1.12 92.2,41.15 93.11,42.05 C6.1 v98.3,40.39
  Bottom 0.406: R34.2 41.91,8.89 36.58,14.22 36.58,16.51 38.35,18.29 55.63,18.29 56.39,17.53 58.67,17.53 59.44,18.29 70.36,18.29 72.39,20.83 72.39,26.67 83.31,37.59 90.42,37.59 93.22,40.39 v98.3,40.39
N$65
  Top 0.406: IC3.2 59.56,22.23 59.94,21.84 59.94,17.51 R4.2 59.63,17.19 D2.K 55.37,19.03 C3.1
N$66
  Top 0.406: R36.1 99.3,51.07 99.57,50.8 100.57,49.78 R41.1 100.58,48.5 100.58,47.24 99.82,46.48 95,46.48 94.74,46.23 U1.1
N$67
  Top 0.406: R5.1 54.98,24.04 R6.2 55.5,21.97 56.52,20.96 IC3.3
N$68
  Top 0.406: 52.72,21.72 R6.1 44.58,21.97 41.66,19.05 28.19,19.05 26.67,17.53 R33.2
N$69
  Top 0.406: X2.1 15.24,40.64 16.51,39.37 16.51,33.02 16.76,32.77 C17.2 18.53,32.54 R30.1
N$70
  Top 0.406: C19.1 R31.1
N$71
  Top 0.406: C18.1 R20.2 | R29.1 R20.2 | IC2.6 37.72,25.02 37.34,25.4 37.34,28.7 37.58,28.94 R20.2
N$72
  Top 0.406: R20.1 35.56,30.24 35.56,28.45 35.81,28.19 35.81,26.67 35.43,26.29 IC2.2 | R20.1 C18.2 | R31.2 R20.1
N$73
  Top 0.406: C16.1 R27.2 R32.1 | C16.1 C19.2 | IC1.6 26.04,25.02 25.65,25.4 25.65,28.45 26.15,28.94 C16.1
N$74
  Top 0.406: JP2.3 36.32,36.83 39.39,33.77 C20.1
N$75
  Top 0.406: U1.8 U1.9
N$76
  Top 0.406: R32.2 30.21,33.29 29.21,34.29 JP2.1
N$77  (via drill 0.25)
  Top 0.406: 66.29,10.95 IC7.4 63.81,12.64 63.37,13.08 R7.1 59.82,13.1 R4.1 | 66.29,10.95 68.28,10.95 D4.K 71.12,13.79 71.12,22.86 68.83,25.15 v68.83,31.5 IC5.2 | R1.1 66.29,10.95
  Bottom 0.305: LED2.A 10.16,107.95 13.97,104.14 13.97,49.53 22.1,41.4 38.86,41.4 41.66,38.61 64.01,38.61 66.8,35.81 66.8,33.53 v68.83,31.5
N$78
  Top 0.406: R7.2 56.09,13.08 D2.A
N$79
  Top 0.406: 99.06,53.09 R36.2 | Q4.1 96.45,56.71 98.3,54.86 99.04,54.86 R37.1 99.06,53.09 | 99.06,53.09 103.12,53.09 103.89,53.85 103.89,56.56 Q3.1
N$80
  Top 0.406: LED2.K 11.41,105.41 R52.1
N$81
  Top 0.406: LED1.K 11.43,80.01 R12.1
N$82
  Top 0.406: U1.2 93.47,47.48 C13.2 94.5,49.51 91.95,52.07 R38.1 88.9,52.34 | R40.2 88.9,52.34 | R48.1 R39.2 88.9,52.34
N$83
  Top 0.406: U1.3 92.2,45.72 92.46,45.97 92.46,50.04 91.44,51.05 86.11,51.05 | 86.11,51.05 85.87,51.05 C15.1 | R42.1 R35.2 86.11,51.05
N$84
  Top 0.406: R40.1 C14.1
N$85
  Top 1.016: R54.2 25.15,141.48 24.64,140.97 24.64,137.92 | 24.64,137.92 24.64,135.89 | 24.64,135.89 24.64,135.64 25.15,135.13 R24.2 | R53.2 24.89,138.18 24.64,137.92 | C118.1 24.64,135.89
N$86
  Top 0.406: TP25.TP 85.6,46.5 R35.1 87.12,47.01 | U1.6 88.39,46.48 87.87,47.01 87.12,47.01 | U1.7 87.12,47.01
N$87
  Top 0.406: R41.2 C13.1
N$88
  Top 0.406: U1.5 89.66,42.16 88.88,41.39 R43.2 83.57,41.64 Q2.3
N$91  (3 unrouted)
N$92  (3 unrouted)
READY
  Top 0.406: IC6.5 67.65,33.53 IC5.1
RESET  (via drill 0.25)
  Top 0.406: IC6.3 65.28,30.99 v66.29,29.97
  Bottom 0.305: SW2.3 2.54,58.42 3.81,57.15 3.81,55.88 20.57,39.12 38.1,39.12 42.93,34.29 46.23,34.29 54.36,26.16 62.99,26.16 63.75,26.92 63.75,28.43 R8.1
  Bottom 0.406: C4.1 65.15,31.12 v66.29,29.97 65.15,28.83 R8.1
S1_BP2
  Top 0.406: C11.2 R19.2 21.08,54.54 R18.1
S1_BP3
  Top 0.406: R21.1 31.62,51.2 L2.1 28.72,54.61 R22.1 28.69,54.61 C11.1 25.65,54.59 R17.2
S1_BP4
  Top 0.406: Q1.G L2.2 | L2.2 33.91,51.2 R21.2 | L2.2 33.91,57.78 R14.1 TP20.TP
  Bottom 0.61: R23.1 43.32,55.1 Q1.G
S1_BP5  (via drill 0.25)
  Top 0.406: R48.2 91.95,59.18 v91.19,59.94
  Top 0.813: Q1.S 41.92,49.53 R15.1 38.87,43.43 TP21.TP
  Bottom 0.406: Q1.S 45.72,49.53 48.26,46.99 77.98,46.99 89.66,58.42 v91.19,59.94
  Bottom 0.813: TP21.TP 39.12,45.98 R16.1
S2_BP1
  Top 0.406: 18.03,54.54 R26.1 18.03,51.82 15.24,49.02 15.24,45.72 21.59,39.37 30.48,39.37 31.75,38.1 JP2.2 | 18.03,54.54 R19.1 | 18.03,54.54 TP27.TP
S2_DP
  Top 0.61: Q1.D 48.51,52.07 | 48.51,52.07 48.51,56.13 44.96,59.69 C7.2 | C8.2 65.91,40.77 64.31,42.37 L1.1 62.5,46.99 59.69,49.8 C1.2 57.42,52.34 57.15,52.07 48.51,52.07
S2_GBIAS  (via drill 0.25)
  Top 0.305: v42.42,39.37 40.64,39.37
  Top 0.406: R37.2 TP23.TP | TP23.TP 96.27,58.93 94.55,57.22 Q4.2 94.55,55.69 93.2,54.34 | Q3.2 101.67,57.85 100.58,58.93 TP23.TP | R25.1 39.1,40.91 40.64,39.37 | R38.2 93.2,54.34 | 93.2,54.34 93.98,53.56 v93.98,53.34
  Bottom 0.305: 91.95,53.09 78.23,39.37 v42.42,39.37
  Bottom 0.406: v93.98,53.34 93.73,53.09 91.95,53.09
S3_GBIAS  (via drill 0.25)
  Top 0.406: Q303.2 101.67,33.72 100.84,34.54 TP11.TP | R316.2 TP11.TP | TP11.TP 96.01,34.54 94.55,33.09 Q302.2 94.55,31.56 93.2,30.21 R317.2 | R110.1 75.95,114.81 v76.2,115.06 | R209.1 75.95,89.66 v76.2,89.92 | R108.1 25.65,90.17 v25.91,89.92 | R207.1 25.65,65.28 v25.91,65.02
  Bottom 0.406: TP11.TP 100.08,34.54 101.09,35.56 101.09,58.67 96.27,63.5 95.25,63.5 76.2,82.3 v76.2,89.92 v76.2,115.06 73.15,115.06 70.1,118.11 62.99,118.11 52.83,107.95 27.94,107.95 25.91,105.92 v25.91,89.92 v25.91,65.02
T1_CT  (via drill 0.25)
  Top 0.61: T1.2 67.9,62.69 69.9,64.69 v69.85,64.69 T1.12
  Bottom 0.61: R101.1 v69.85,64.69
T1_P1
  Top 0.61: T1.7 67.1,54.69 65.1,56.69 T1.5
T1_P2
  Top 0.61: T1.4 65.39,58.69 67.39,56.69 T1.8
T1_P3
  Top 0.61: T1.9 68.44,58.69 66.44,60.69 T1.3
VB  (via drill 0.6)
  Top 0.406: 85.34,128.93 L402.2
  Top 0.61: 88.77,138.43 R405.2 | R405.2 87.12,138.43 85.34,136.65 85.34,128.93 | R404.2 R405.2 | 78.74,60.96 87.96,70.18 87.96,126.01 L402.2 | 78.74,60.96 78.74,48.26 77.47,46.99 75.86,46.99 C29.1 75.52,46.99 L1.2 70.31,42.24 C8.1 | T1.10 78.47,60.69 78.74,60.96
  Top 1.016: L103.2 29.11,130.7 29.21,130.81 v31.75,130.81 v33.02,130.81 v34.29,130.81 | L104.2 73.66,130.81 | 73.66,130.81 74.93,130.81 76.2,132.08 v76.2,134.62 | L104.2 72.5,130.7 71.12,132.08 v71.12,134.62 | 73.66,130.81 v73.66,134.62 | v80.34,128.78 75.59,128.78 L104.2
  Top 2.54: L402.2 v80.34,128.78
  pour Bottom (isolate 0.406): 25.4,138.43 77.47,138.43 77.47,124.46 25.4,124.46
VB_CONN
  Top 1.778: J401.1 110.83,14.86 F401.1
VB_CT  (via drill 0.38)
  Top 1.27: T102.7 v52.07,125.73 v50.55,125.73 v48.77,125.73 48.01,125.73 45.47,128.27 T102.5
  Bottom 0.813: R132.2 v50.55,125.73
  Bottom 1.27: v52.07,125.73 v50.55,125.73 v48.77,125.73
VB_FUSED
  Top 0.406: F401.2 112.45,33.4 D401.K
  Top 1.778: F401.2 R401.1
VB_ICL  (4 unrouted)
  Top 2.54: L401.1 119.89,128.78 121.92,126.75 121.92,117.05 C402.1 121.72,116.79 121.92,116.59

## Text on the board
tPlace: RF OUT | 1A FUSE | DC SUPPLY / 35-50VDC | DUTY LIMIT | STAGE 3 | PULSE LIMIT | STAGE 2 | EASY RFPA FAB | Rev B | Mike Twieg 2022036